# Altium project Edge_Card_Ucc28951.PrjPcb (part 1 of 3)
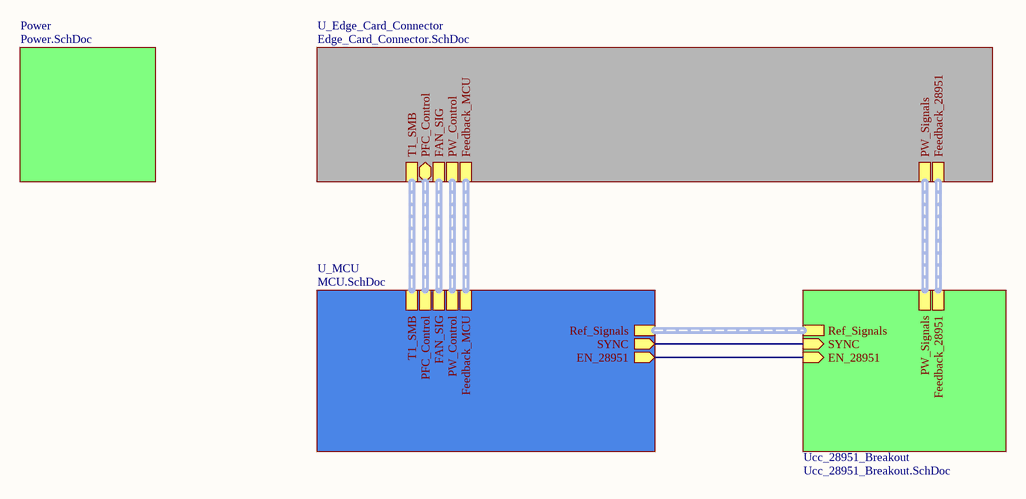
[diagram p0: Edge_Card_Ucc28951.SchDoc]
12 sheets, 320 parts. Net scope: hierarchical (ports join the sheet entries above them; power ports are global).
Board file: Edge_Card_Ucc28951.PcbDoc
Sheets:
  Edge_Card_Ucc28951.SchDoc
    U_Edge_Card_Connector = Edge_Card_Connector.SchDoc
    U_MCU = MCU.SchDoc
      MCU_Breakout = MCU_Breakout.SchDoc
        U_MCU_Power = MCU_Power.SchDoc
      MCU_JTAG = MCU_Debug.SchDoc
      MCU_USB = MCU_USB.SchDoc
      MCU_LCD = MCU_LCD.SchDoc
      IR_Reciever = IR_Reciever.SchDoc
      MCU_CAN = MCU_CAN.SchDoc
    Power = Power.SchDoc
    Ucc_28951_Breakout = Ucc_28951_Breakout.SchDoc

## Sheet Edge_Card_Ucc28951.SchDoc
size A4

### Sub-sheets
Power = Power.SchDoc: no entries
U_Edge_Card_Connector = Edge_Card_Connector.SchDoc: Feedback_28951 (harness Feedback_28951), Feedback_MCU (harness Feedback_MCU), FAN_SIG (harness FAN_SIG), PFC_Control (bidir, harness PFC_Control), T1_SMB (harness T1_SMB), PW_Signals (harness PW_Signals), PW_Control (harness PW_Control)
U_MCU = MCU.SchDoc: T1_SMB (harness T1_SMB), PFC_Control (harness PFC_Control), FAN_SIG (harness FAN_SIG), PW_Control (harness PW_Control), Feedback_MCU (harness Feedback_MCU), SYNC (out), EN_28951 (out), Ref_Signals (harness Ref_Signals)
Ucc_28951_Breakout = Ucc_28951_Breakout.SchDoc: PW_Signals (harness PW_Signals), Feedback_28951 (harness Feedback_28951), EN_28951 (in), SYNC (in), Ref_Signals (harness Ref_Signals)

### Nets
EN_28951: sheet U_MCU/EN_28951, sheet Ucc_28951_Breakout/EN_28951
SYNC: sheet U_MCU/SYNC, sheet Ucc_28951_Breakout/SYNC

### Buses and harness runs
harness sheet U_Edge_Card_Connector/FAN_SIG = sheet U_MCU/FAN_SIG
harness sheet U_Edge_Card_Connector/Feedback_28951 = sheet Ucc_28951_Breakout/Feedback_28951
harness sheet U_Edge_Card_Connector/Feedback_MCU = sheet U_MCU/Feedback_MCU
harness sheet U_Edge_Card_Connector/PFC_Control = sheet U_MCU/PFC_Control
harness sheet U_Edge_Card_Connector/PW_Control = sheet U_MCU/PW_Control
harness sheet U_Edge_Card_Connector/PW_Signals = sheet Ucc_28951_Breakout/PW_Signals
harness sheet U_Edge_Card_Connector/T1_SMB = sheet U_MCU/T1_SMB
harness sheet U_MCU/Ref_Signals = sheet Ucc_28951_Breakout/Ref_Signals

## Sheet Edge_Card_Connector.SchDoc
size A3
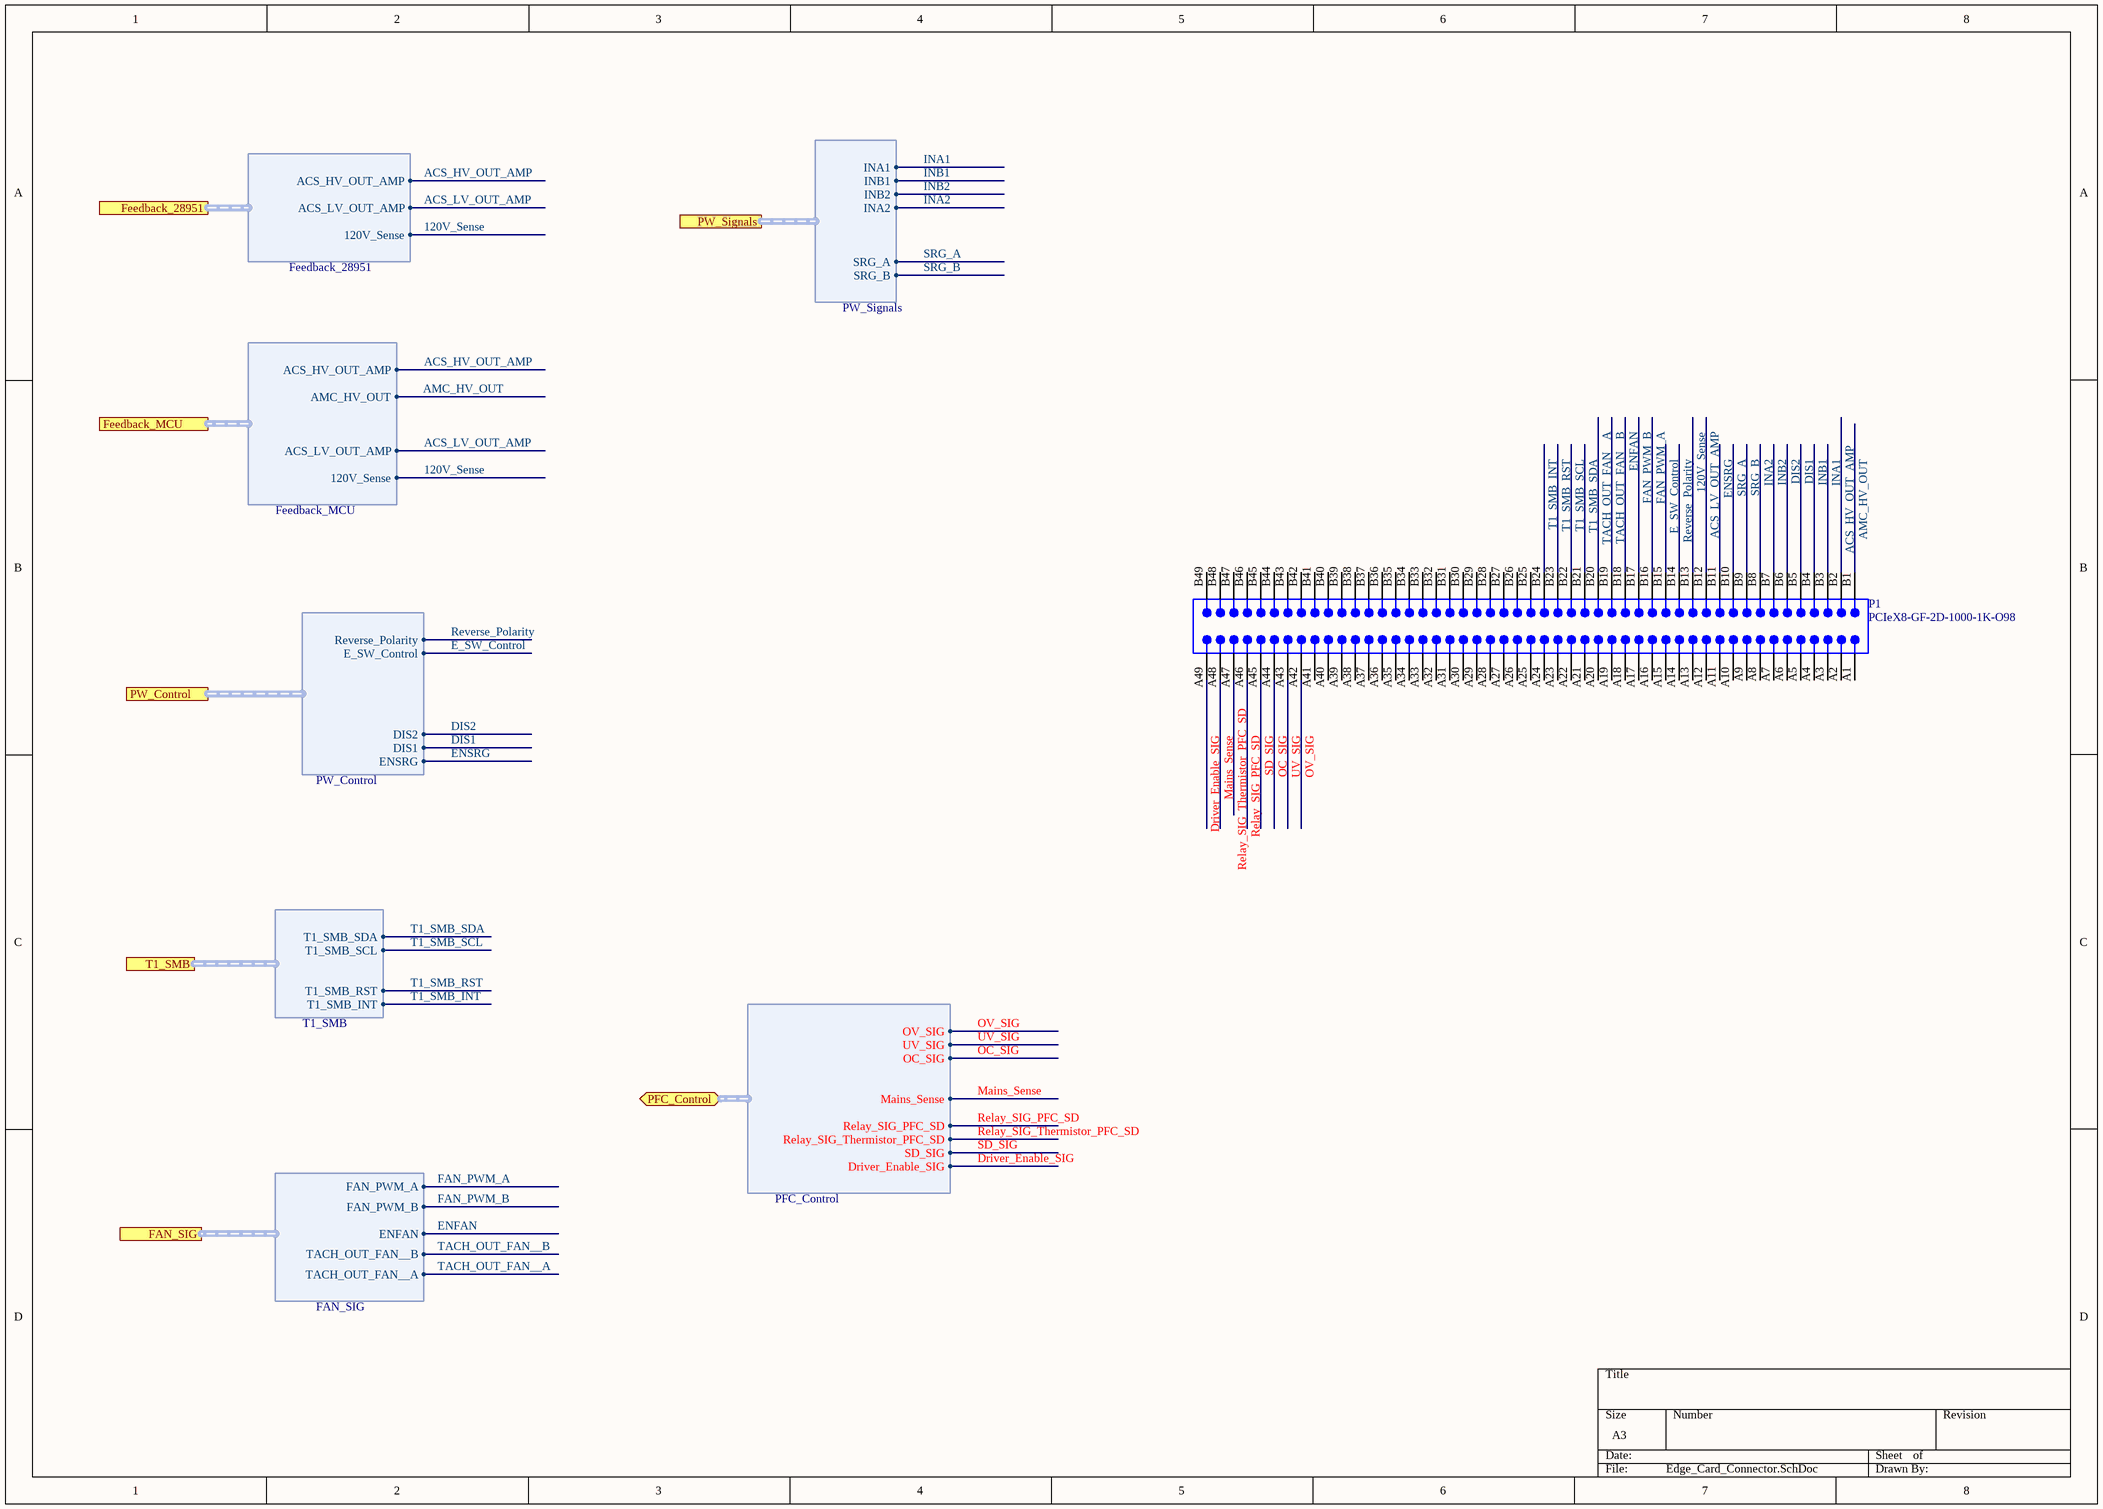
[diagram p1: Edge_Card_Connector.SchDoc]

### Parts
P1  PCIeX8-GF-2D-1000-1K-O98  [PCIeX8-GF-2D-1000-1K-O98]  (no BOM)

### Ports
FAN_SIG (harness FAN_SIG), Feedback_28951 (harness Feedback_28951), Feedback_MCU (harness Feedback_MCU), PFC_Control (bidir, harness PFC_Control), PW_Control (harness PW_Control), PW_Signals (harness PW_Signals), T1_SMB (harness T1_SMB)

### Harnesses
Feedback_28951: ACS_HV_OUT_AMP, 120V_Sense, ACS_LV_OUT_AMP
PW_Signals: INA1, INA2, INB1, INB2, SRG_A, SRG_B
Feedback_MCU: 120V_Sense, ACS_LV_OUT_AMP, ACS_HV_OUT_AMP, AMC_HV_OUT
PW_Control: E_SW_Control, Reverse_Polarity, DIS2, DIS1, ENSRG
FAN_SIG: ENFAN, FAN_PWM_A, FAN_PWM_B, TACH_OUT_FAN__A, TACH_OUT_FAN__B
T1_SMB: T1_SMB_INT, T1_SMB_RST, T1_SMB_SCL, T1_SMB_SDA
PFC_Control: Relay_SIG_Thermistor_PFC_SD, Mains_Sense, Driver_Enable_SIG, Relay_SIG_PFC_SD, UV_SIG, OV_SIG, SD_SIG, OC_SIG

### Nets
120V_Sense: P1.B13 ; port Feedback_28951.120V_Sense, port Feedback_MCU.120V_Sense
ACS_HV_OUT_AMP: P1.B2 ; port Feedback_28951.ACS_HV_OUT_AMP, port Feedback_MCU.ACS_HV_OUT_AMP
ACS_LV_OUT_AMP: P1.B12 ; port Feedback_28951.ACS_LV_OUT_AMP, port Feedback_MCU.ACS_LV_OUT_AMP
AMC_HV_OUT: P1.B1 ; port Feedback_MCU.AMC_HV_OUT
DIS1: P1.B5 ; port PW_Control.DIS1
DIS2: P1.B6 ; port PW_Control.DIS2
Driver_Enable_SIG: P1.A49 ; port PFC_Control.Driver_Enable_SIG
E_SW_Control: P1.B15 ; port PW_Control.E_SW_Control
ENFAN: P1.B18 ; port FAN_SIG.ENFAN
ENSRG: P1.B11 ; port PW_Control.ENSRG
FAN_PWM_A: P1.B16 ; port FAN_SIG.FAN_PWM_A
FAN_PWM_B: P1.B17 ; port FAN_SIG.FAN_PWM_B
INA1: P1.B3 ; port PW_Signals.INA1
INA2: P1.B8 ; port PW_Signals.INA2
INB1: P1.B4 ; port PW_Signals.INB1
INB2: P1.B7 ; port PW_Signals.INB2
Mains_Sense: P1.A48 ; port PFC_Control.Mains_Sense
OC_SIG: P1.A44 ; port PFC_Control.OC_SIG
OV_SIG: P1.A42 ; port PFC_Control.OV_SIG
Relay_SIG_PFC_SD: P1.A46 ; port PFC_Control.Relay_SIG_PFC_SD
Relay_SIG_Thermistor_PFC_SD: P1.A47 ; port PFC_Control.Relay_SIG_Thermistor_PFC_SD
Reverse_Polarity: P1.B14 ; port PW_Control.Reverse_Polarity
SD_SIG: P1.A45 ; port PFC_Control.SD_SIG
SRG_A: P1.B10 ; port PW_Signals.SRG_A
SRG_B: P1.B9 ; port PW_Signals.SRG_B
T1_SMB_INT: P1.B24 ; port T1_SMB.T1_SMB_INT
T1_SMB_RST: P1.B23 ; port T1_SMB.T1_SMB_RST
T1_SMB_SCL: P1.B22 ; port T1_SMB.T1_SMB_SCL
T1_SMB_SDA: P1.B21 ; port T1_SMB.T1_SMB_SDA
TACH_OUT_FAN__A: P1.B20 ; port FAN_SIG.TACH_OUT_FAN__A
TACH_OUT_FAN__B: P1.B19 ; port FAN_SIG.TACH_OUT_FAN__B
UV_SIG: P1.A43 ; port PFC_Control.UV_SIG

Not connected (* = marked no-connect by the designer): P1 A1 A2 A3 A4 A5 A6 A7 A8 A9 A10 A11 A12 A13 A14 A15 A16 A17 A18 A19 A20 A21 A22 A23 A24 A25 A26 A27 A28 A29 A30 A31 A32 A33 A34 A35 A36 A37 A38 A39 A40 A41 B25 B26 B27 B28 B29 B30 B31 B32 B33 B34 B35 B36 B37 B38 B39 B40 B41 B42 B43 B44 B45 B46 B47 B48 B49

### Library data of the parts
P1 = PCIeX8-GF-2D-1000-1K-O98: Golden finger, PCIeX8, Dual, Opposite, Pitch 1mm, 98-Position; Mating Connector: Molex-87715-9205; Package Version: rev2.0, Apr-2007; ClassName: Edge Connector; Package Reference: GF-2D-1000-1K-O98; Datasheet Version: rev2.0, Apr-2007; Publisher: Altium

## Sheet MCU.SchDoc
size A4
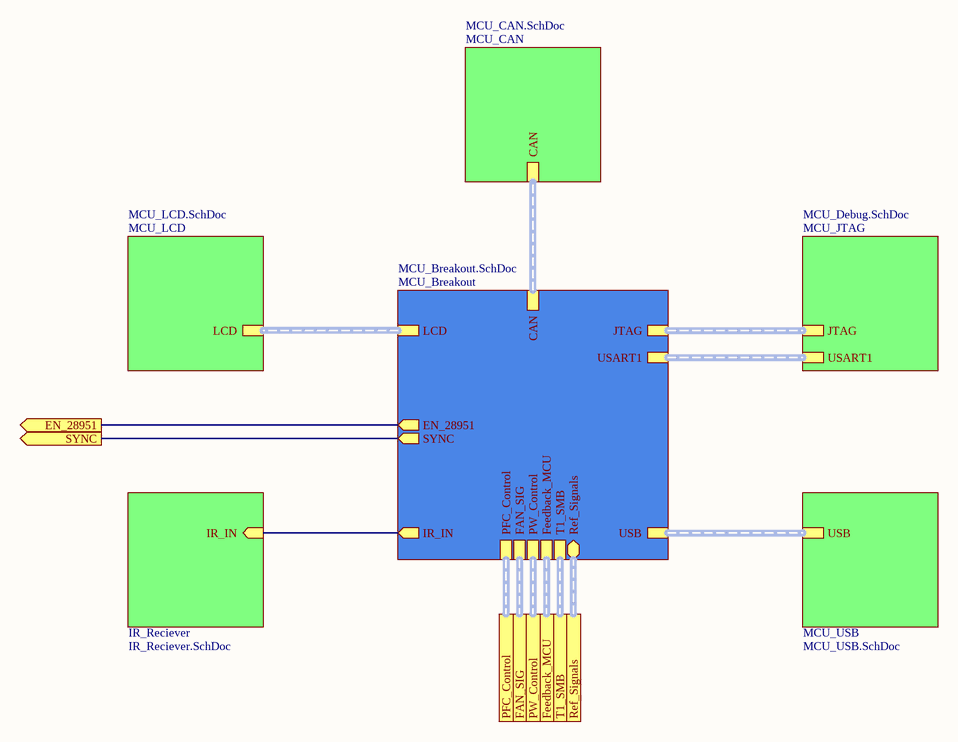
[diagram p2: MCU.SchDoc]

### Sub-sheets
IR_Reciever = IR_Reciever.SchDoc: IR_IN (in)
MCU_Breakout = MCU_Breakout.SchDoc: JTAG (harness JTAG), USB (harness USB), IR_IN (out), CAN (harness FD_CAN), LCD (harness LCD), T1_SMB (harness T1_SMB), Feedback_MCU (harness Feedback_MCU), PW_Control (harness PW_Control), FAN_SIG (harness FAN_SIG), PFC_Control (harness PFC_Control), USART1 (harness USART1), Ref_Signals (bidir, harness Ref_Signals), SYNC (out), EN_28951 (out)
MCU_CAN = MCU_CAN.SchDoc: CAN
MCU_JTAG = MCU_Debug.SchDoc: JTAG (harness JTAG), USART1 (harness USART1)
MCU_LCD = MCU_LCD.SchDoc: LCD
MCU_USB = MCU_USB.SchDoc: USB

### Ports
EN_28951 (out), FAN_SIG (harness FAN_SIG), Feedback_MCU (harness Feedback_MCU), PFC_Control (harness PFC_Control), PW_Control (harness PW_Control), Ref_Signals (harness Ref_Signals), SYNC (out), T1_SMB (harness T1_SMB)

### Nets
EN_28951: port EN_28951, sheet MCU_Breakout/EN_28951
IR_IN: sheet MCU_Breakout/IR_IN, sheet IR_Reciever/IR_IN
SYNC: port SYNC, sheet MCU_Breakout/SYNC

### Buses and harness runs
harness port FAN_SIG = sheet MCU_Breakout/FAN_SIG
harness port Feedback_MCU = sheet MCU_Breakout/Feedback_MCU
harness port PFC_Control = sheet MCU_Breakout/PFC_Control
harness port PW_Control = sheet MCU_Breakout/PW_Control
harness port Ref_Signals = sheet MCU_Breakout/Ref_Signals
harness port T1_SMB = sheet MCU_Breakout/T1_SMB
harness sheet MCU_Breakout/CAN = sheet MCU_CAN/CAN
harness sheet MCU_Breakout/JTAG = sheet MCU_JTAG/JTAG
harness sheet MCU_Breakout/LCD = sheet MCU_LCD/LCD
harness sheet MCU_Breakout/USART1 = sheet MCU_JTAG/USART1
harness sheet MCU_Breakout/USB = sheet MCU_USB/USB

## Sheet MCU_Breakout.SchDoc
size C
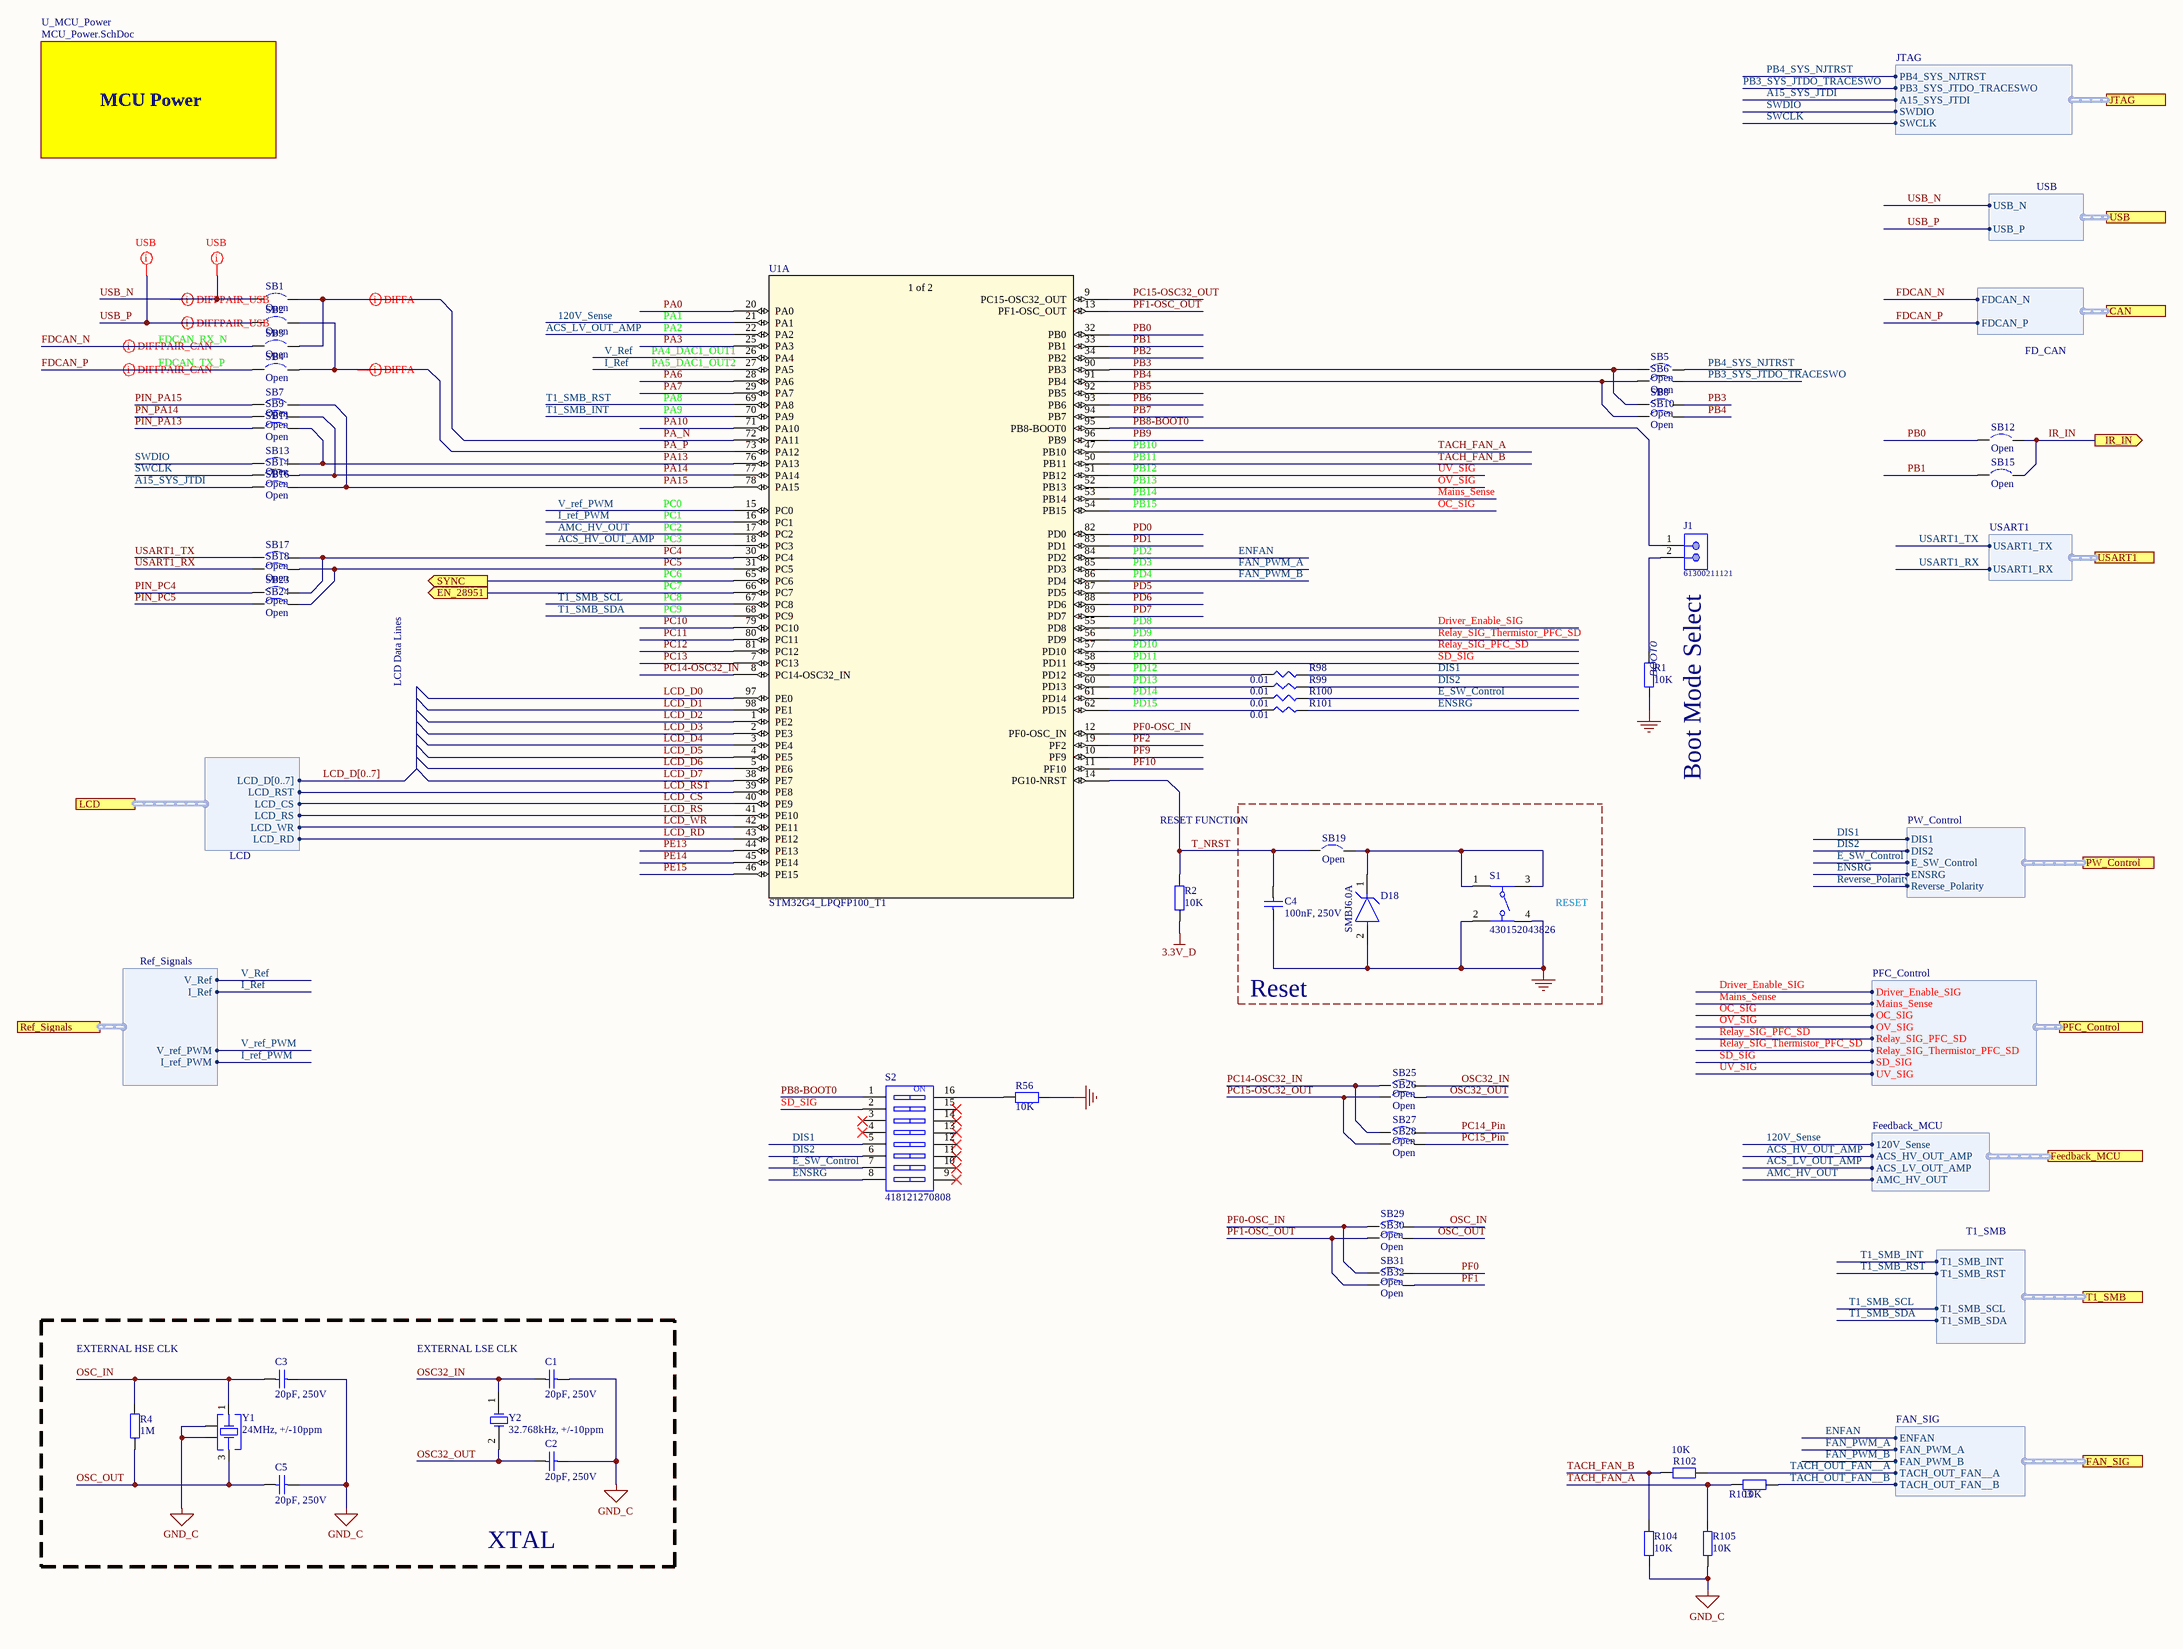
[diagram p3: MCU_Breakout.SchDoc]

### Parts
C1  20pF, 250V  [WCAP-CSMH_0603_Reflow]
C2  20pF, 250V  [WCAP-CSMH_0603_Reflow]
C3  20pF, 250V  [WCAP-CSMH_0603_Reflow]
C4  100nF, 250V  [WCAP-CSMH_0603_Reflow]
C5  20pF, 250V  [WCAP-CSMH_0603_Reflow]
D18  SMBJ6.0A  [FP-SMBJ-MFG]
J1  61300211121  [61300211121]
R1  10K  [WRIS-KSKE_0603_H=0.45mm]
R2  10K  [WRIS-KSKE_0603_H=0.45mm]
R4  1M  [WRIS-KSKE_0603_H=0.45mm]
R56  10K  [WRIS-KSKE_0603_H=0.45mm]
R98  0.01  [SMD-0603-RES]
R99  0.01  [SMD-0603-RES]
R100  0.01  [SMD-0603-RES]
R101  0.01  [SMD-0603-RES]
R102  10K  [WRIS-KSKE_0603_H=0.45mm]
R103  10K  [WRIS-KSKE_0603_H=0.45mm]
R104  10K  [WRIS-KSKE_0603_H=0.45mm]
R105  10K  [WRIS-KSKE_0603_H=0.45mm]
S1  430152043826  [430152043826]
S2  418121270808  [418121270808]
SB1  Open  [SB_0603]  (no BOM)
SB2  Open  [SB_0603]  (no BOM)
SB3  Open  [SB_0603]  (no BOM)
SB4  Open  [SB_0603]  (no BOM)
SB5  Open  [SB_0603]  (no BOM)
SB6  Open  [SB_0603]  (no BOM)
SB7  Open  [SB_0603]  (no BOM)
SB8  Open  [SB_0603]  (no BOM)
SB9  Open  [SB_0603]  (no BOM)
SB10  Open  [SB_0603]  (no BOM)
SB11  Open  [SB_0603]  (no BOM)
SB12  Open  [SB_0603]  (no BOM)
SB13  Open  [SB_0603]  (no BOM)
SB14  Open  [SB_0603]  (no BOM)
SB15  Open  [SB_0603]  (no BOM)
SB16  Open  [SB_0603]  (no BOM)
SB17  Open  [SB_0603]  (no BOM)
SB18  Open  [SB_0603]  (no BOM)
SB19  Open  [SB_0603]  (no BOM)
SB23  Open  [SB_0603]  (no BOM)
SB24  Open  [SB_0603]  (no BOM)
SB25  Open  [SB_0603]  (no BOM)
SB26  Open  [SB_0603]  (no BOM)
SB27  Open  [SB_0603]  (no BOM)
SB28  Open  [SB_0603]  (no BOM)
SB29  Open  [SB_0603]  (no BOM)
SB30  Open  [SB_0603]  (no BOM)
SB31  Open  [SB_0603]  (no BOM)
SB32  Open  [SB_0603]  (no BOM)
U1  STM32G4_LPQFP100_T1  [TSQFP50P1600X1600X160-100N]  (part A of 2)
Y1  24MHz, +/-10ppm  [WE-XTAL_CFPX-180]
Y2  32.768kHz, +/-10ppm  [WE-XTAL_IQXC-25]

### Blocks framed on the sheet
Reset: C4 D18 S1 SB19
XTAL: C1-C3 C5 R4 Y1 Y2

### Sub-sheets
U_MCU_Power = MCU_Power.SchDoc: no entries

### Ports
CAN (harness FD_CAN), EN_28951 (out), FAN_SIG (harness FAN_SIG), Feedback_MCU (harness Feedback_MCU), IR_IN (out), JTAG (harness JTAG), LCD (harness LCD), PFC_Control (harness PFC_Control), PW_Control (harness PW_Control), Ref_Signals (harness Ref_Signals), SYNC (out), T1_SMB (harness T1_SMB), USART1 (harness USART1), USB (harness USB)

### Harnesses
JTAG: PB3_SYS_JTDO_TRACESWO, PB4_SYS_NJTRST, SWDIO, SWCLK, A15_SYS_JTDI
USB: USB_N, USB_P
FD_CAN: FDCAN_N, FDCAN_P
LCD: LCD_RST, LCD_CS, LCD_RS, LCD_D[0..7], LCD_WR, LCD_RD
USART1: USART1_TX, USART1_RX
T1_SMB: T1_SMB_INT, T1_SMB_RST, T1_SMB_SCL, T1_SMB_SDA
Feedback_MCU: 120V_Sense, ACS_HV_OUT_AMP, ACS_LV_OUT_AMP, AMC_HV_OUT
PFC_Control: Driver_Enable_SIG, Mains_Sense, OC_SIG, OV_SIG, Relay_SIG_PFC_SD, Relay_SIG_Thermistor_PFC_SD, SD_SIG, UV_SIG
PW_Control: DIS1, DIS2, E_SW_Control, ENSRG, Reverse_Polarity
Ref_Signals: V_Ref, I_Ref, V_ref_PWM, I_ref_PWM
FAN_SIG: ENFAN, FAN_PWM_A, FAN_PWM_B, TACH_OUT_FAN__A, TACH_OUT_FAN__B

### Nets
3.3V_D: R2.1
GND: C4.1 D18.2(A) R1.1 R56.1 S1.2 S1.4
GND_C: C1.2 C2.2 C3.2 C5.2 R104.2 R105.2 Y1.2(GND) Y1.4(GND)
120V_Sense: U1.21(PA1) ; port Feedback_MCU.120V_Sense
A15_SYS_JTDI: SB16.2 ; port JTAG.A15_SYS_JTDI
ACS_HV_OUT_AMP: U1.18(PC3) ; port Feedback_MCU.ACS_HV_OUT_AMP
ACS_LV_OUT_AMP: U1.22(PA2) ; port Feedback_MCU.ACS_LV_OUT_AMP
AMC_HV_OUT: U1.17(PC2) ; port Feedback_MCU.AMC_HV_OUT
DIS1: R98.2 S2.5 ; port PW_Control.DIS1
DIS2: R99.2 S2.6 ; port PW_Control.DIS2
Driver_Enable_SIG: U1.55(PD8) ; port PFC_Control.Driver_Enable_SIG
E_SW_Control: R100.2 S2.7 ; port PW_Control.E_SW_Control
EN_28951: U1.66(PC7) ; port EN_28951
ENFAN: U1.84(PD2) ; port FAN_SIG.ENFAN
ENSRG: R101.2 S2.8 ; port PW_Control.ENSRG
FAN_PWM_A: U1.85(PD3) ; port FAN_SIG.FAN_PWM_A
FAN_PWM_B: U1.86(PD4) ; port FAN_SIG.FAN_PWM_B
FDCAN_N: SB3.1 ; port CAN.FDCAN_N
FDCAN_P: SB4.1 ; port CAN.FDCAN_P
I_Ref: U1.27(PA5) ; port Ref_Signals.I_Ref
I_ref_PWM: U1.16(PC1) ; port Ref_Signals.I_ref_PWM
IR_IN: SB12.1 SB15.1 ; port IR_IN
LCD_CS: U1.40(PE9) ; port LCD.LCD_CS
LCD_D0: U1.97(PE0)
LCD_D1: U1.98(PE1)
LCD_D2: U1.1(PE2)
LCD_D3: U1.2(PE3)
LCD_D4: U1.3(PE4)
LCD_D5: U1.4(PE5)
LCD_D6: U1.5(PE6)
LCD_D7: U1.38(PE7)
LCD_RD: U1.43(PE12) ; port LCD.LCD_RD
LCD_RS: U1.41(PE10) ; port LCD.LCD_RS
LCD_RST: U1.39(PE8) ; port LCD.LCD_RST
LCD_WR: U1.42(PE11) ; port LCD.LCD_WR
Mains_Sense: U1.53(PB14) ; port PFC_Control.Mains_Sense
OC_SIG: U1.54(PB15) ; port PFC_Control.OC_SIG
OSC32_IN: C1.1 SB25.1 Y2.1(OSC1)
OSC32_OUT: C2.1 SB26.1 Y2.2(OSC2)
OSC_IN: C3.1 R4.2 SB29.1 Y1.1(Crystal)
OSC_OUT: C5.1 R4.1 SB30.1 Y1.3(Crystal)
OV_SIG: U1.52(PB13) ; port PFC_Control.OV_SIG
PA0: U1.20(PA0)
PA3: U1.25(PA3)
PA6: U1.28(PA6)
PA7: U1.29(PA7)
PA10: U1.71(PA10)
PA13: SB11.1 SB13.1 U1.76(PA13)
PA14: SB9.1 SB14.1 U1.77(PA14)
PA15: SB7.1 SB16.1 U1.78(PA15)
PA_N: SB1.2 SB3.2 U1.72(PA11)
PA_P: SB2.2 SB4.2 U1.73(PA12)
PB0: SB12.2 U1.32(PB0)
PB1: SB15.2 U1.33(PB1)
PB2: U1.34(PB2)
PB3: SB5.2 SB8.1 SB8.2 U1.90(PB3)
PB3_SYS_JTDO_TRACESWO: SB6.1 ; port JTAG.PB3_SYS_JTDO_TRACESWO
PB4: SB6.2 SB10.1 SB10.2 U1.91(PB4)
PB4_SYS_NJTRST: SB5.1 ; port JTAG.PB4_SYS_NJTRST
PB5: U1.92(PB5)
PB6: U1.93(PB6)
PB7: U1.94(PB7)
PB8-BOOT0: J1.1 S2.1 U1.95(PB8-BOOT0)
PB9: U1.96(PB9)
PC4: SB17.1 SB23.1 U1.30(PC4)
PC5: SB18.1 SB24.1 U1.31(PC5)
PC10: U1.79(PC10)
PC11: U1.80(PC11)
PC12: U1.81(PC12)
PC13: U1.7(PC13)
PC14-OSC32_IN: SB25.2 SB27.2 U1.8(PC14-OSC32_IN)
PC14_Pin: SB27.1
PC15-OSC32_OUT: SB26.2 SB28.2 U1.9(PC15-OSC32_OUT)
PC15_Pin: SB28.1
PD0: U1.82(PD0)
PD1: U1.83(PD1)
PD5: U1.87(PD5)
PD6: U1.88(PD6)
PD7: U1.89(PD7)
PE13: U1.44(PE13)
PE14: U1.45(PE14)
PE15: U1.46(PE15)
PF0: SB31.1
PF0-OSC_IN: SB29.2 SB31.2 U1.12(PF0-OSC_IN)
PF1: SB32.1
PF1-OSC_OUT: SB30.2 SB32.2 U1.13(PF1-OSC_OUT)
PF2: U1.19(PF2)
PF9: U1.10(PF9)
PF10: U1.11(PF10)
PIN_PA13: SB11.2
PIN_PA15: SB7.2
PIN_PC4: SB23.2
PIN_PC5: SB24.2
PN_PA14: SB9.2
Relay_SIG_PFC_SD: U1.57(PD10) ; port PFC_Control.Relay_SIG_PFC_SD
Relay_SIG_Thermistor_PFC_SD: U1.56(PD9) ; port PFC_Control.Relay_SIG_Thermistor_PFC_SD
SD_SIG: S2.2 U1.58(PD11) ; port PFC_Control.SD_SIG
SWCLK: SB14.2 ; port JTAG.SWCLK
SWDIO: SB13.2 ; port JTAG.SWDIO
SYNC: U1.65(PC6) ; port SYNC
T1_SMB_INT: U1.70(PA9) ; port T1_SMB.T1_SMB_INT
T1_SMB_RST: U1.69(PA8) ; port T1_SMB.T1_SMB_RST
T1_SMB_SCL: U1.67(PC8) ; port T1_SMB.T1_SMB_SCL
T1_SMB_SDA: U1.68(PC9) ; port T1_SMB.T1_SMB_SDA
T_NRST: C4.2 R2.2 SB19.2 U1.14(PG10-NRST)
TACH_FAN_A: R103.2 R105.1 U1.47(PB10)
TACH_FAN_B: R102.1 R104.1 U1.50(PB11)
TACH_OUT_FAN__A: R102.2 ; port FAN_SIG.TACH_OUT_FAN__A
TACH_OUT_FAN__B: R103.1 ; port FAN_SIG.TACH_OUT_FAN__B
USART1_RX: SB18.2 ; port USART1.USART1_RX
USART1_TX: SB17.2 ; port USART1.USART1_TX
USB_N: SB1.1 ; port USB.USB_N
USB_P: SB2.1 ; port USB.USB_P
UV_SIG: U1.51(PB12) ; port PFC_Control.UV_SIG
V_Ref: U1.26(PA4) ; port Ref_Signals.V_Ref
V_ref_PWM: U1.15(PC0) ; port Ref_Signals.V_ref_PWM
NetD18_1: D18.1(C) S1.1 S1.3 SB19.1
NetJ1_2: J1.2 R1.2
NetR56_2: R56.2 S2.16
NetR98_1: R98.1 U1.59(PD12)
NetR99_1: R99.1 U1.60(PD13)
NetR100_1: R100.1 U1.61(PD14)
NetR101_1: R101.1 U1.62(PD15)

Not connected (* = marked no-connect by the designer): S2 3* 4* 9* 10* 11* 12* 13* 14* 15*

### Buses and harness runs
bus LCD_D[0..7]

### Layout directives
differential pair: FDCAN_N, FDCAN_P, PA_N, PA_P
rule Undefined; rule Matched Net Lengths [Tolerance = 0.2mm]; rule Impedance Constraint [Min = 85.00    Max = 95.00    ]: USB_N, USB_P
differential pair; rule Impedance Constraint [Min = 85.00    Max = 95.00    ]: USB_N, USB_P

### Notes on the sheet
- MCU Power
- FDCAN_RX_N
- PA4_DAC1_OUT1
- PA1
- PA2
- FDCAN_TX_P
- PA5_DAC1_OUT2
- PA9
- PA8
- PB12
- PB11
- PB10
- PC0
- PC1
- PC2
- PB13
- PB14
- PB15
- PC3
- PC6
- PC7
- PD3
- PD4
- PD2
- PC9
- PC8
- PD8
- PD9
- PD10
- (near R1) BOOT0
- LCD Data Lines
- PD11
- PD12
- PD13
- PD14
- PD15
- (near SB19) RESET FUNCTION
- Boot Mode Select
- (near S1) RESET
- EXTERNAL HSE CLK
- EXTERNAL LSE CLK
- (in symbol 418121270808) ON
- (in symbol STM32G4_LPQFP100, part A) 1 of 2

### Library data of the parts
C1-C5 = 885342006002: WCAP-CSMH Ceramic Capacitors, size 0603, 33pF, 250VDC; Ceramic Type: NP0 Class I; Insulation Resistance: 10GOhm; Technical Reference: NP00603330J250DFCT10000; ComponentLink1Description: Manufacturer; ComponentLink1URL: http://www.we-online.de; ComponentLink2Description: Datasheet; ComponentLink2URL: https://katalog.we-online.com/pbs/datasheet/885342006002.pdf; Packaging: Tape and Reel; Part Number: 885342006002; Published Date: August 2019; Rated Voltage: 250VDC; Size: 0603; Mounting Technology: SMD; Publisher: Wurth Elektronik; Capacitance: 33pF; Dissipation Factor: -; Operating Temperature: -55 to +125degC
D18 = CMP-08607-000069-1: TVS DIODE 6V 10.3V DO214AA; Manufacturer: Littelfuse Inc; Breakdown Voltage: 6.67V; Direction: Unidirectional; Number Of Channels: 1; Peak Pulse Power: 600W; Peak Pulse Current: 58.3A; Max Junction Temp: +150°C; Category: Diode; ComponentLink2Description: Datasheet; Octopart: https://octopart.com/smbj6.0a-littelfuse-66100; Clamping Voltage: 10.3V; Device Class L3: unset; Temperature Range Low: -65°C; Temperature: -65°C to +150°C; ComponentLink2URL: https://www.littelfuse.com/~/media/electronics/datasheets/tvs_diodes/littelfuse_tvs_diode_smbj_datasheet.pdf.pdf; Height: 2.61mm; Digikey Description: TVS DIODE 6V 10.3V DO214AA; Manufacturer Part Number: SMBJ6.0A; Temperature Range High: +150°C; Device Class L2: TVS Diodes; Mouser Description: In a Pack of 10, Littelfuse SMBJ6.0A, Uni-Directional TVS Diode, 600W, 2-Pin DO-214AA; Automotive: No; RoHS: TRUE; Device Class L1: Circuit Protection; Reverse Standoff Voltage: 6V; Lead Free: Yes; Package: SMBJ
J1 = 61300211121: WR-PHD Pin Header, THT, pitch 2.54mm, Single Row, Vertical, 2pin; Pin Number: 2; Gender: Male; Rated Current: 3A; Working Voltage: 250VAC; Withstanding Voltage: 500VAC; Contact Resistance: 20mOhm; ComponentLink1Description: Manufacturer; ComponentLink1URL: http://www.we-online.de; ComponentLink2Description: Datasheet; ComponentLink2URL: https://katalog.we-online.de/em/datasheet/6130xx11121.pdf; Part Number: 61300211121; Published Date: June 2019; Publisher: Wurth Elektronik; Pitch: 2.54mm; Operating Temperature: -40 to +105degC; Mounting Technology: THT; Packaging: Bag; Row Number: Single; Orientation: Vertical
R1 R2 R4 R56 R102-R105 = 560050316011: WRIS-KSKE Thick Film Resistors, size 0603, 0.5Ohm, +/-1%, 0.25W; Rated Current: 0.7A; Temperature Coefficient of Resistance: +/-100ppm/degC; Technical Reference: KE0603R500F104KAATP0000; ComponentLink1Description: Manufacturer; ComponentLink1URL: http://www.we-online.de; ComponentLink2Description: Datasheet; ComponentLink2URL: https://katalog.we-online.com/pbs/datasheet/560050316011.pdf; Publisher: Wurth Elektronik; Rated Power: 0.25W; Resistance: 0.5Ohm; Mounting Technology: SMT; Height: 0.45mm; Part Number: 560050316011; Packaging: Tape and Reel; Published Date: September 2019; Size: 0603; Length: 1.6mm; Operating Temperature: -55 to +155degC; Resistance Tolerance: +/-1%; Width: 0.8mm
R98-R101 = ERJ-3LWFR010V: RES SMD 0.01 OHM 1% 1/4W 0603; Manufacturer: Panasonic Electronic Components; Factory Stock: 0; Unit Price (USD): 0.09082; @ qty: 1500; Minimum Quantity: 1; Power (Watts): 0.25W, 1/4W; Temperature Coefficient: 0/ +300ppm/°C; Part Number: ERJ-3LWFR010V; Datasheets: https://industrial.panasonic.com/cdbs/www-data/pdf/RDA0000/AOA0000C239.pdf; Image: //media.digikey.com/Photos/Panasonic%20Photos/MFG_ERJ-P6W%20Series.jpg; Digi-Key Part Number: P19180CT-ND; Quantity Available: 105; Packaging: Cut Tape (CT); Series: ERJ; Part Status: Active; Value: 0.01; Tolerance: ±1%; Composition: Thick Film; Features: Automotive AEC-Q200, Current Sense; Operating Temperature: -55°C ~ 125°C; Package / Case: 0603 (1608 Metric); Supplier Device Package: 0603; Size / Dimension: 0.063" L x 0.031" W (1.60mm x 0.80mm); Height - Seated (Max): 0.026" (0.65mm); Number of Terminations: 2; Failure Rate: -
S1 = 430152043826: WS-TASV SMT Tact Switch 6x6mm, height 4.3mm, 260gf; Rated Voltage: 12VDC; Rated Current: 50mA; Washable: No; ComponentLink1Description: Manufacturer; ComponentLink1URL: http://www.we-online.de; ComponentLink2Description: Datasheet; ComponentLink2URL: https://katalog.we-online.com/em/datasheet/430152043826.pdf; Operating Temperature: -40 to +85degC; Part Number: 430152043826; Published Date: September 2019; Contact Material: Stainless Steel; Height: 4.3mm; Mounting Technology: SMT; Contact Plating: Silver; Operation Force: 260gf; Packaging: Tape and Reel; Terminal Material: Copper Alloy; Publisher: Wurth Elektronik; Terminal Plating: Silver
S2 = 418121270808: WS-DISV Small Compact SMT Dip Switch, Raised Actuator, pitch 2.54mm, 8p; Operation Force: 600g; Pole Number: 8; Actuator Type: Raise Type; Circuit: SPST-NO; Rated Current Switching: 25mA; Rated Current Non-Switching: 100mA; Rated Voltage Non-Switching: 50VDC; Rated Voltage Switching: 24VDC; ComponentLink1Description: Manufacturer; ComponentLink1URL: http://www.we-online.de; ComponentLink2Description: Datasheet; ComponentLink2URL: https://katalog.we-online.com/em/datasheet/418121270808.pdf; Pitch: 2.54mm; Contact Material: Copper Alloy; Mounting Technology: SMT; Operating Temperature: -40 to +85degC; Contact Plating: Gold; Packaging: Tape and Reel; Part Number: 418121270808; Publisher: Wurth Elektronik; Published Date: September 2019
SB1-SB19 SB23-SB32 = Solder Bridge: Circuit Breaker; Published: 24-Mar-1999; Revision: July-2002: Re-released for DXP Platform.; Publisher: Altium Limited
U1 = STM32G4_LPQFP100: No Description Available; Vendor: STMicroelectronics; Built_By: EMA_Jessica; Manufacturer_Part_Number: STM32G4_LPQFP100_T1; Copyright: Copyright (C) 2016 Accelerated Designs. All rights reserved; RefDes: RefDes; Type: DEV
Y1 = 830058149: WE-XTAL Quartz Crystal, SMT, CFPX-180, 24MHz, +/-10ppm; Load Capacitance: 10pF; ComponentLink1Description: Manufacturer; ComponentLink1URL: http://www.we-online.de; ComponentLink2Description: Datasheet; ComponentLink2URL: https://katalog.we-online.com/pbs/datasheet/830058149.pdf; Operating Temperature: -20 to +70degC; Packaging: Tape and Reel; Part Number: 830058149; Published Date: November 2019; Size: CFPX-180; Frequency Stability: +/-10ppm; Frequency: 24MHz; Frequency Tolerance: +/-10ppm; Mounting Technology: SMT; Publisher: Wurth Elektronik
Y2 = 830062558: WE-XTAL Watch Crystal, SMT, IQXC-25, 32.768kHz, +/-10ppm; Load Capacitance: 9pF; ComponentLink1Description: Manufacturer; ComponentLink1URL: http://www.we-online.de; ComponentLink2Description: Datasheet; ComponentLink2URL: https://katalog.we-online.com/pbs/datasheet/830062558.pdf; Operating Temperature: -40 to +85degC; Packaging: Tape and Reel; Part Number: 830062558; Published Date: November 2019; Size: IQXC-25; Frequency Stability: -; Frequency: 32.768kHz; Frequency Tolerance: +/-10ppm; Mounting Technology: SMT; Publisher: Wurth Elektronik

## Sheet MCU_Power.SchDoc
size A3
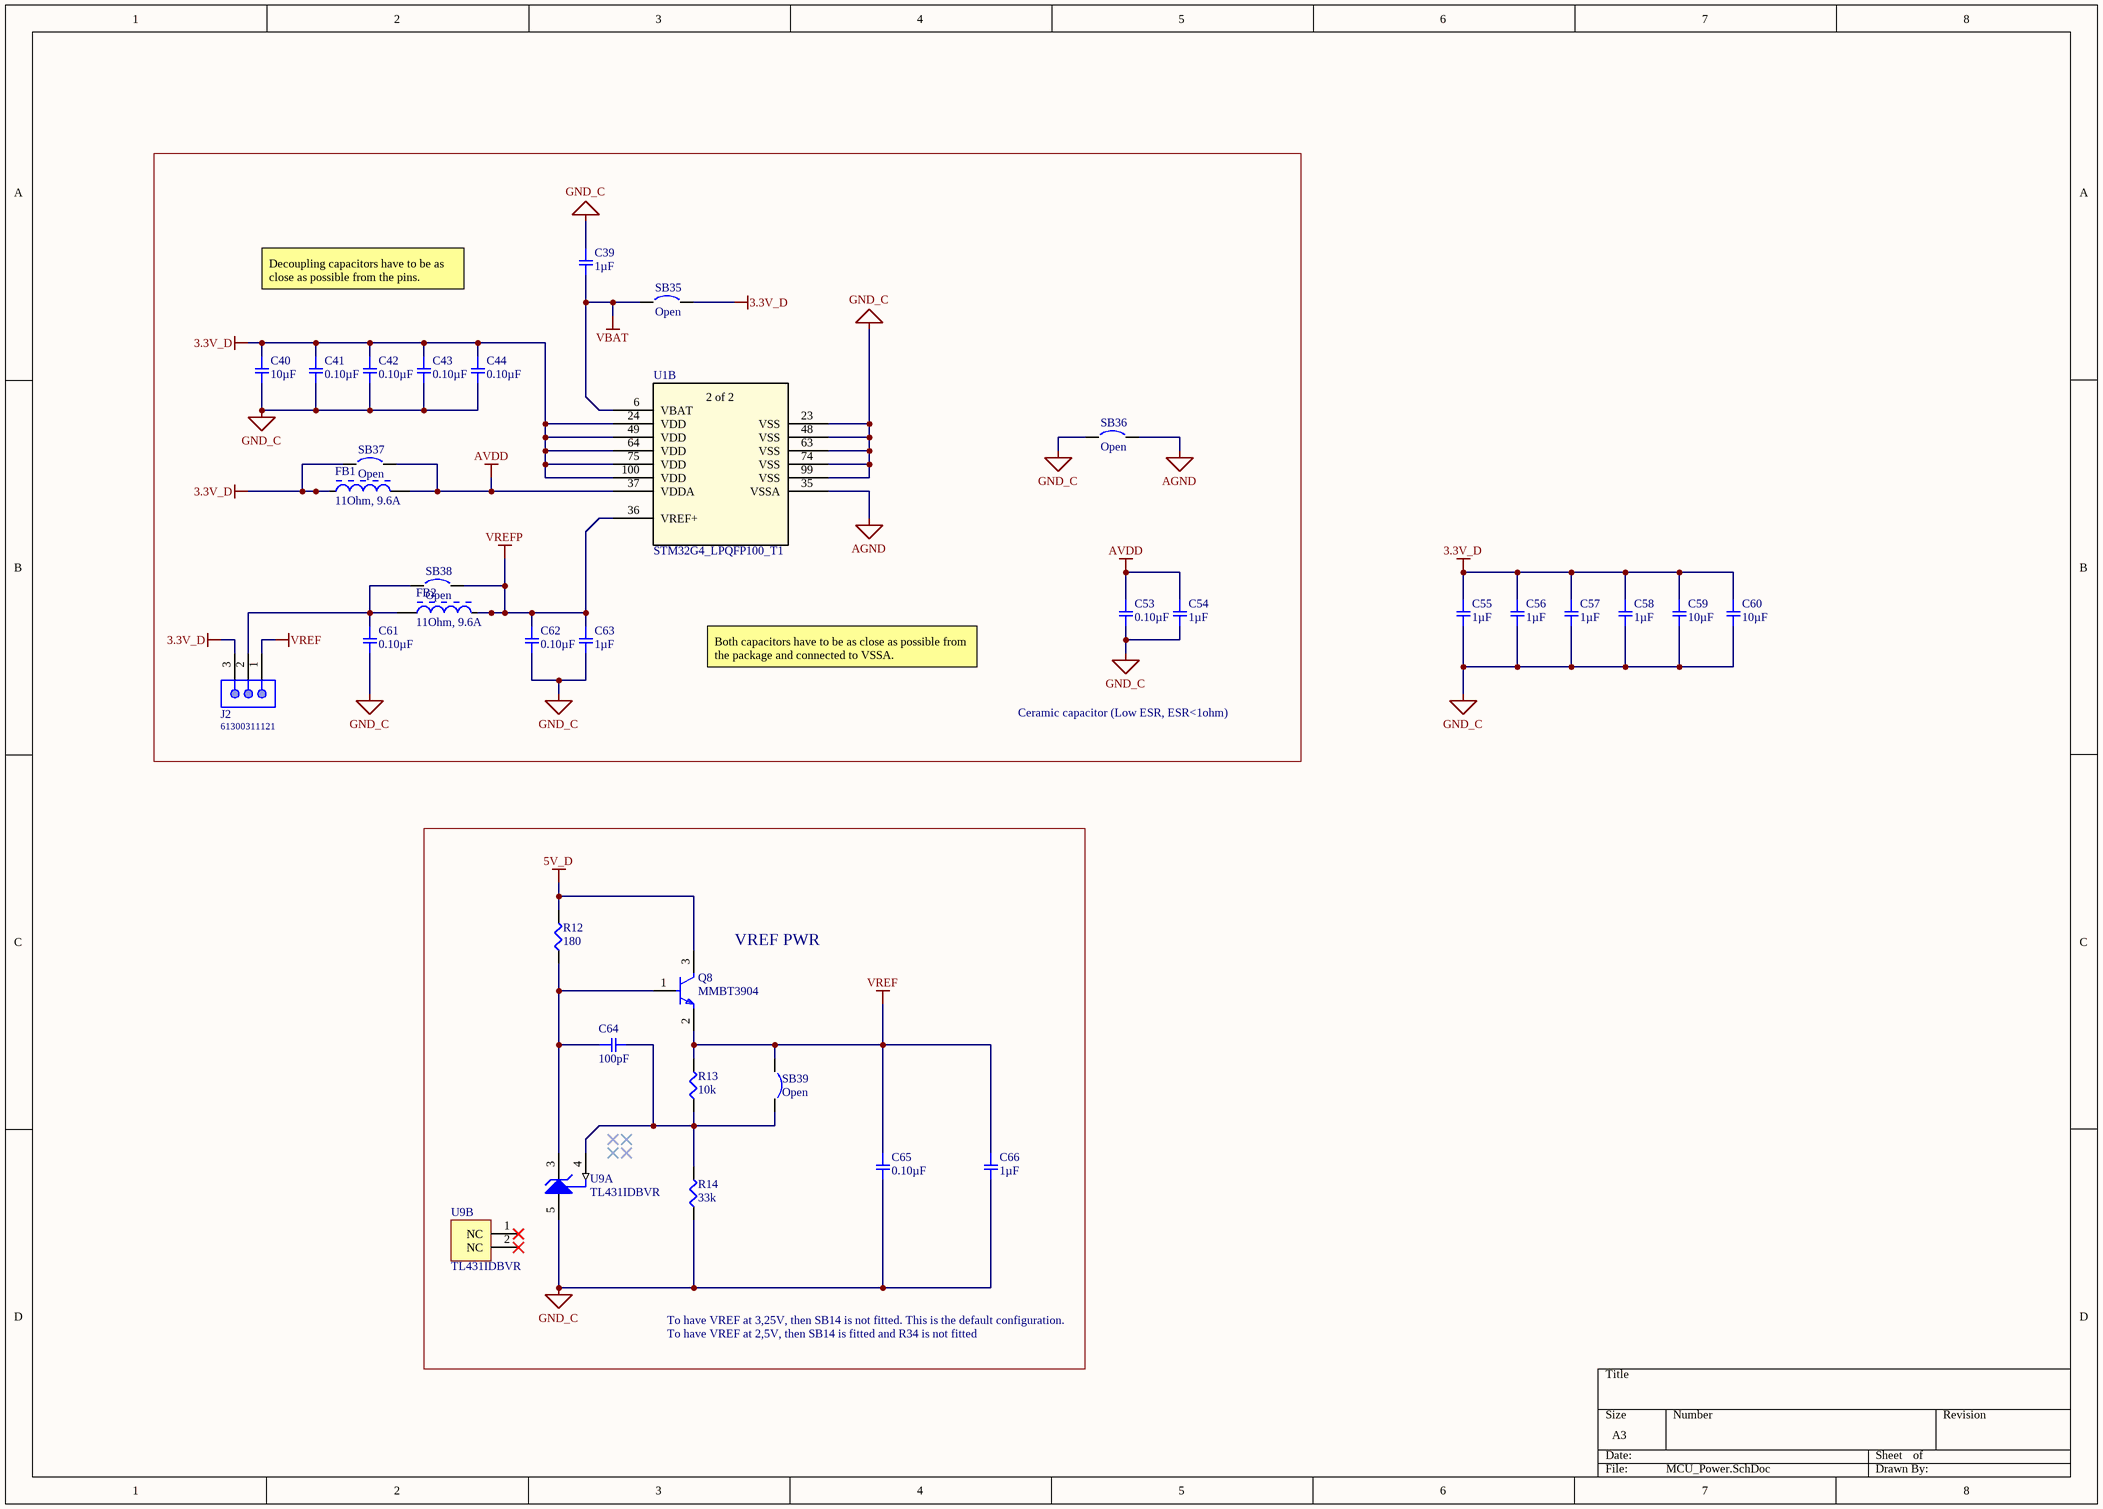
[diagram p4: MCU_Power.SchDoc]

### Parts
C39  1µF  [SMD-0805C]
C40  10µF  [SMD-0805C]
C41  0.10µF  [SMD-0805C]
C42  0.10µF  [SMD-0805C]
C43  0.10µF  [SMD-0805C]
C44  0.10µF  [SMD-0805C]
C53  0.10µF  [SMD-0805C]
C54  1µF  [SMD-0805C]
C55  1µF  [SMD-0805C]
C56  1µF  [SMD-0805C]
C57  1µF  [SMD-0805C]
C58  1µF  [SMD-0805C]
C59  10µF  [SMD-0805C]
C60  10µF  [SMD-0805C]
C61  0.10µF  [SMD-0805C]
C62  0.10µF  [SMD-0805C]
C63  1µF  [SMD-0805C]
C64  100pF  [SMD-0805C]
C65  0.10µF  [SMD-0805C]
C66  1µF  [SMD-0805C]
FB1  11Ohm, 9.6A  [WE-CBF_0805_High Speed]
FB2  11Ohm, 9.6A  [WE-CBF_0805_High Speed]
J2  61300311121  [61300311121]
Q8  MMBT3904  [FP-MA03D-MFG]
R12  180  [SMD-0603-RES]
R13  10k  [SMD-0603-RES]
R14  33k  [SMD-0603-RES]
SB35  Open  [SB_0603]  (no BOM)
SB36  Open  [SB_0603]  (no BOM)
SB37  Open  [SB_0603]  (no BOM)
SB38  Open  [SB_0603]  (no BOM)
SB39  Open  [SB_0603]  (no BOM)
U1  STM32G4_LPQFP100_T1  [TSQFP50P1600X1600X160-100N]  (part B of 2)
U9  TL431IDBVR  [DBV0005A_M]  (parts A,B of 2)

### Blocks framed on the sheet
Ceramic capacitor (Low ESR, ESR<1ohm): C39-C44 C53 C54 C61-C63 FB1 FB2 J2 SB35-SB38 U1
VREF PWR: C64-C66 Q8 R12-R14 SB39 U9

### Nets
3.3V_D: C40.1 C41.1 C42.1 C43.1 C44.1 C55.1 C56.1 C57.1 C58.1 C59.1 C60.1 FB1.1 J2.3 SB35.2 SB37.1 U1.24(VDD) U1.49(VDD) U1.64(VDD) U1.75(VDD) U1.100(VDD)
5V_D: Q8.3(C) R12.2
AGND: SB36.2 U1.35(VSSA)
AVDD: C53.1 C54.1 FB1.2 SB37.2 U1.37(VDDA)
GND_C: C39.1 C40.2 C41.2 C42.2 C43.2 C44.2 C53.2 C54.2 C55.2 C56.2 C57.2 C58.2 C59.2 C60.2 C61.2 C62.2 C63.2 C65.2 C66.2 R14.1 SB36.1 U1.23(VSS) U1.48(VSS) U1.63(VSS) U1.74(VSS) U1.99(VSS) U9.5(ANODE)
VBAT: C39.2 SB35.1 U1.6(VBAT)
VREF: C65.1 C66.1 J2.1 Q8.2(E) R13.2 SB39.1
VREFP: C62.1 C63.1 FB2.2 SB38.2 U1.36(VREF+)
NetC61_1: C61.1 FB2.1 J2.2 SB38.1
NetC64_1: C64.1 Q8.1(B) R12.1 U9.3(CATHODE)
NetC64_2: C64.2 R13.1 R14.2 SB39.2 U9.4(REF)

Not connected (* = marked no-connect by the designer): U9 1(NC)* 2(NC)*

### Notes on the sheet
- Decoupling capacitors have to be as close as possible from the pins.
- Both capacitors have to be as close as possible from the package and connected to VSSA.
- To have VREF at 3,25V, then SB14 is not fitted. This is the default configuration.
- To have VREF at 2,5V, then SB14 is fitted and R34 is not fitted
- (in symbol STM32G4_LPQFP100, part B) 2 of 2

### Library data of the parts
C39 C54-C58 C63 C66 = GCM219R71C105KA37D: CAP CER 1UF 16V X7R 0805; Manufacturer: Murata Electronics North America; Factory Stock: 0; Unit Price (USD): 0.17; Minimum Quantity: 1; Tolerance: ±10%; Datasheets: http://www.murata.com/~/media/webrenewal/support/library/catalog/products/capacitor/mlcc/c03e.ashx; Image: //media.digikey.com/photos/Murata%20Photos/NCP,GCM%20SERIES%200805.jpg; Digi-Key Part Number: 490-8043-1-ND; Part Number: GCM219R71C105KA37D; Quantity Available: 11770; @ qty: 0; Packaging: Cut Tape (CT); Series: GCM; Part Status: Active; Value: 1µF; Voltage: 16V; Temperature Coefficient: X7R; Operating Temperature: -55°C ~ 125°C; Features: -; Ratings: AEC-Q200; Applications: Automotive; Mounting Type: Surface Mount, MLCC; Package / Case: 0805 (2012 Metric); Size / Dimension: 0.079" L x 0.049" W (2.00mm x 1.25mm); Height - Seated (Max): -; Thickness (Max): 0.037" (0.95mm); Lead Spacing: -; Lead Style: -
C40 C59 C60 = GCM21BR71A106KE22L: CAP CER 10UF 10V X7R 0805; Manufacturer: Murata Electronics North America; Factory Stock: 0; Unit Price (USD): 0.49; Minimum Quantity: 1; Tolerance: ±10%; Datasheets: http://www.murata.com/~/media/webrenewal/support/library/catalog/products/capacitor/mlcc/c03e.ashx; Image: //media.digikey.com/photos/Murata%20Photos/NCP,GCM%20SERIES%200805.jpg; Digi-Key Part Number: 490-10674-1-ND; Part Number: GCM21BR71A106KE22L; Quantity Available: 125344; @ qty: 0; Packaging: Cut Tape (CT); Series: GCM; Part Status: Active; Value: 10µF; Voltage: 10V; Temperature Coefficient: X7R; Operating Temperature: -55°C ~ 125°C; Features: -; Ratings: AEC-Q200; Applications: Automotive; Mounting Type: Surface Mount, MLCC; Package / Case: 0805 (2012 Metric); Size / Dimension: 0.079" L x 0.049" W (2.00mm x 1.25mm); Height - Seated (Max): -; Thickness (Max): 0.055" (1.40mm); Lead Spacing: -; Lead Style: -
C41-C44 C53 C61 C62 C65 = GCJ21BR72A104KA01L: CAP CER 0.1UF 100V X7R 0805; Manufacturer: Murata Electronics North America; Factory Stock: 0; Unit Price (USD): 0.32; Minimum Quantity: 1; Tolerance: ±10%; Datasheets: http://www.murata.com/~/media/webrenewal/support/library/catalog/products/capacitor/mlcc/c03e.ashx; Image: //media.digikey.com/Renders/Murata%20Renders/0805%20(2012%20Metric)%20.85mm.jpg; Digi-Key Part Number: 490-5825-1-ND; Part Number: GCJ21BR72A104KA01L; Quantity Available: 1873; @ qty: 0; Packaging: Cut Tape (CT); Series: GCJ; Part Status: Active; Value: 0.10µF; Voltage: 100V; Temperature Coefficient: X7R; Operating Temperature: -55°C ~ 125°C; Features: Soft Termination; Ratings: AEC-Q200; Applications: Automotive, Boardflex Sensitive; Mounting Type: Surface Mount, MLCC; Package / Case: 0805 (2012 Metric); Size / Dimension: 0.079" L x 0.049" W (2.00mm x 1.25mm); Height - Seated (Max): -; Thickness (Max): 0.049" (1.25mm); Lead Spacing: -; Lead Style: -
C64 = GCM2165C2A101JA16J: CAP CER 100PF 100V NP0 0805; Manufacturer: Murata Electronics North America; Factory Stock: 0; Unit Price (USD): 0.17; Minimum Quantity: 1; Tolerance: ±5%; Temperature Coefficient: C0G, NP0; Datasheets: http://www.murata.com/~/media/webrenewal/support/library/catalog/products/capacitor/mlcc/c03e.ashx; Image: //media.digikey.com/Renders/Murata%20Renders/0805%28GxM6%29.jpg; Digi-Key Part Number: 490-8036-1-ND; Part Number: GCM2165C2A101JA16J; Quantity Available: 19299; @ qty: 0; Packaging: Cut Tape (CT); Series: GCM; Part Status: Active; Value: 100pF; Voltage: 100V; Operating Temperature: -55°C ~ 125°C; Features: -; Ratings: AEC-Q200; Applications: Automotive; Mounting Type: Surface Mount, MLCC; Package / Case: 0805 (2012 Metric); Size / Dimension: 0.079" L x 0.049" W (2.00mm x 1.25mm); Height - Seated (Max): -; Thickness (Max): 0.028" (0.70mm); Lead Spacing: -; Lead Style: -
FB1 FB2 = 7427920: WE-CBF SMT EMI Suppression Ferrite Bead, size 0805, 11Ohm, 9.6A; Manufacturer: Wurth Elektronik; Impedance max.: 24Ohm; DC Resistance max.: 0.15Ohm; Type: High Speed; ComponentLink1Description: Manufacturer; ComponentLink1URL: http://www.we-online.de; ComponentLink2Description: Datasheet; ComponentLink2URL: https://www.we-online.com/catalog/datasheet/7427920.pdf; Operating Temperature: -55 to +125degC; Packaging: Tape and Reel; Published Date: March 2020; Rated Current: 9.6A; Manufacturer Part Number: 7427920; Impedance @100MHz: 11Ohm; Mounting Technology: SMT; Size: 0805
J2 = 61300311121: WR-PHD Pin Header, THT, pitch 2.54mm, Single Row, Vertical, 3pin; Pin Number: 3; Gender: Male; Rated Current: 3A; Working Voltage: 250VAC; Withstanding Voltage: 500VAC; Contact Resistance: 20mOhm; ComponentLink1Description: Manufacturer; ComponentLink1URL: http://www.we-online.de; ComponentLink2Description: Datasheet; ComponentLink2URL: https://katalog.we-online.de/em/datasheet/6130xx11121.pdf; Part Number: 61300311121; Published Date: June 2019; Publisher: Wurth Elektronik; Pitch: 2.54mm; Operating Temperature: -40 to +105degC; Mounting Technology: THT; Packaging: Bag; Row Number: Single; Orientation: Vertical
Q8 = CMP-07170-000026-1: TRANS NPN 40V 0.2A SOT-23; Frequency: 300MHz; hFE Min: 100; Power Dissipation: 350mW; Element Configuration: Single; Collector Base Voltage (VCBO): 60V; Max Collector Current: 200mA; Number of Elements: 1; Emitter Base Voltage (VEBO): 6V; Collector Emitter Saturation Voltage: 300mV; REACH SVHC: No SVHC; Width: 0.25inch; Mount: Surface Mount; Height: 0.25inch; Case/Package: SOT-23; Radiation Hardening: No; Max Power Dissipation: 350mW; Gain Bandwidth Product: 300MHz; Max Frequency: 300MHz; Collector Emitter Voltage (VCEO): 40V; Max Operating Temperature: 150°C; Termination: SMD/SMT; Weight: 0.03g; Contact Plating: Tin; Package Quantity: 1; Current Rating: 200mA; Max Breakdown Voltage: 40V; Polarity: NPN; Min Operating Temperature: -55°C; Lead Free: Lead Free; Length: 0.25inch; Collector Emitter Breakdown Voltage: 40V; Packaging: Tape and Reel; Voltage Rating (DC): 40V; Number of Pins: 3; Transition Frequency: 300MHz
R12 = ERJ-3EKF1800V: RES SMD 180 OHM 1% 1/10W 0603; Manufacturer: Panasonic Electronic Components; Factory Stock: 0; Unit Price (USD): 0.00379; @ qty: 1500; Minimum Quantity: 1; Power (Watts): 0.1W, 1/10W; Temperature Coefficient: ±100ppm/°C; Part Number: ERJ-3EKF1800V; Datasheets: http://industrial.panasonic.com/www-cgi/jvcr13pz.cgi?E+PZ+3+AOA0002+ERJ3EKF1800V+7+WW; Image: //media.digikey.com/Photos/Panasonic%20Photos/MFG_ERJ-P6W%20Series.jpg; Digi-Key Part Number: P180HCT-ND; Quantity Available: 115705; Packaging: Cut Tape (CT); Series: ERJ; Part Status: Active; Value: 180; Tolerance: ±1%; Composition: Thick Film; Features: Automotive AEC-Q200; Operating Temperature: -55°C ~ 155°C; Package / Case: 0603 (1608 Metric); Supplier Device Package: 0603; Size / Dimension: 0.063" L x 0.031" W (1.60mm x 0.80mm); Height - Seated (Max): 0.022" (0.55mm); Number of Terminations: 2; Failure Rate: -
R13 = ERJ-3EKF1002V: RES SMD 10K OHM 1% 1/10W 0603; Manufacturer: Panasonic Electronic Components; Factory Stock: 0; Unit Price (USD): 0.00379; @ qty: 1500; Minimum Quantity: 1; Power (Watts): 0.1W, 1/10W; Temperature Coefficient: ±100ppm/°C; Part Number: ERJ-3EKF1002V; Datasheets: http://industrial.panasonic.com/www-cgi/jvcr13pz.cgi?E+PZ+3+AOA0002+ERJ3EKF1002V+7+WW; Image: //media.digikey.com/Photos/Panasonic%20Photos/MFG_ERJ-P6W%20Series.jpg; Digi-Key Part Number: P10.0KHCT-ND; Quantity Available: 6703141; Packaging: Cut Tape (CT); Series: ERJ; Part Status: Active; Value: 10k; Tolerance: ±1%; Composition: Thick Film; Features: Automotive AEC-Q200; Operating Temperature: -55°C ~ 155°C; Package / Case: 0603 (1608 Metric); Supplier Device Package: 0603; Size / Dimension: 0.063" L x 0.031" W (1.60mm x 0.80mm); Height - Seated (Max): 0.022" (0.55mm); Number of Terminations: 2; Failure Rate: -
R14 = ERJ-3EKF3302V: RES SMD 33K OHM 1% 1/10W 0603; Manufacturer: Panasonic Electronic Components; Factory Stock: 0; Unit Price (USD): 0.00379; @ qty: 1500; Minimum Quantity: 1; Power (Watts): 0.1W, 1/10W; Temperature Coefficient: ±100ppm/°C; Part Number: ERJ-3EKF3302V; Datasheets: http://industrial.panasonic.com/www-cgi/jvcr13pz.cgi?E+PZ+3+AOA0002+ERJ3EKF3302V+7+WW; Image: //media.digikey.com/Photos/Panasonic%20Photos/MFG_ERJ-P6W%20Series.jpg; Digi-Key Part Number: P33.0KHCT-ND; Quantity Available: 240194; Packaging: Cut Tape (CT); Series: ERJ; Part Status: Active; Value: 33k; Tolerance: ±1%; Composition: Thick Film; Features: Automotive AEC-Q200; Operating Temperature: -55°C ~ 155°C; Package / Case: 0603 (1608 Metric); Supplier Device Package: 0603; Size / Dimension: 0.063" L x 0.031" W (1.60mm x 0.80mm); Height - Seated (Max): 0.022" (0.55mm); Number of Terminations: 2; Failure Rate: -
SB35-SB39 = Solder Bridge: Circuit Breaker; Published: 24-Mar-1999; Revision: July-2002: Re-released for DXP Platform.; Publisher: Altium Limited
U1 = STM32G4_LPQFP100: as U1 on sheet MCU_Breakout; Manufacturer_Part_Number: STM32G4_LPQFP100_T1; Copyright: Copyright (C) 2016 Accelerated Designs. All rights reserved; RefDes: RefDes; Type: DEV
U9 = CMP-0366-00644-2: Adjustable Precision Shunt Regulator, 34 ppm / degC, 100 mA, -40 to 85 degC, 5-pin SOT-23 (DBV), Green (RoHS & no Sb/Br); Manufacturer: Texas Instruments; Iout/Iz(Max)(mA): 100; Min Iz for Regulation(uA): 600; Temp Coeff(Typ)(ppm/ degree C): 34; SubFamily: Shunt Voltage Reference; Temp Coeff(Max)(ppm/ degree C): 92; VO Adj(Min)(V): 2.495; Rating: Military; VO Adj(Max)(V): 36; Initial Accuracy @ 25/deg C(%): 2; Eco-Plan: Green (RoHS & no Sb/Br); Mounting Technology: Surface Mount; Code_JEDEC: MO-178; DatasheetVersion: SLVS543M; ComponentLink3Description: Package Specification; PackageReference: DBV0005A; ComponentLink3URL: http://www.ti.com/litv/pdf/mpds018i; PackageVersion: 4073253-4/K; ComponentLink1URL: http://www.ti.com/; ComponentLink1Description: Manufacturer URL; ComponentLink2URL: http://www.ti.com/general/docs/lit/getliterature.tsp?genericPartNumber=TL431&fileType=pdf; ComponentLink2Description: Datasheet; PackageDescription: 5-Pin Plastic Small Outline, Body 1.60 Ã— 2.90 mm, Pitch 0.95 mm; PartNumber: TL431IDBVR

## Sheet MCU_Debug.SchDoc
size A4
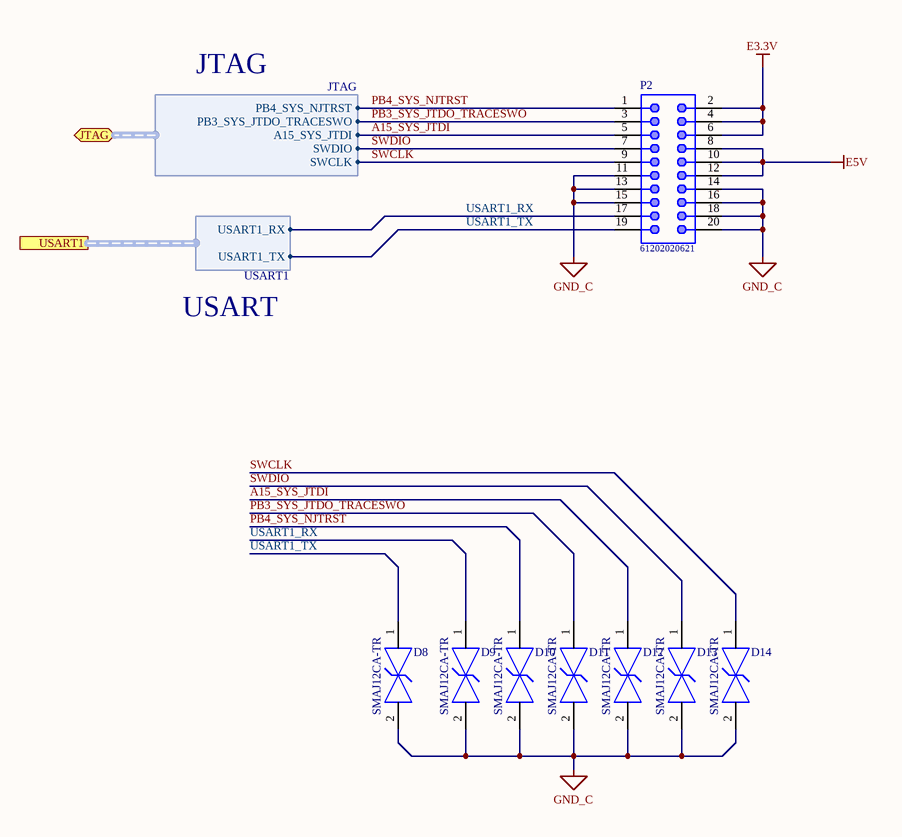
[diagram p5: MCU_Debug.SchDoc]

### Parts
D8  SMAJ12CA-TR  [FP-SMA-CA-MFG]
D9  SMAJ12CA-TR  [FP-SMA-CA-MFG]
D10  SMAJ12CA-TR  [FP-SMA-CA-MFG]
D11  SMAJ12CA-TR  [FP-SMA-CA-MFG]
D12  SMAJ12CA-TR  [FP-SMA-CA-MFG]
D13  SMAJ12CA-TR  [FP-SMA-CA-MFG]
D14  SMAJ12CA-TR  [FP-SMA-CA-MFG]
P2  61202020621  [61202020621]

### Ports
JTAG (bidir, harness JTAG), USART1 (harness USART1)

### Harnesses
JTAG: PB3_SYS_JTDO_TRACESWO, PB4_SYS_NJTRST, SWDIO, SWCLK, A15_SYS_JTDI
USART1: USART1_RX, USART1_TX

### Nets
E3.3V: P2.2 P2.4 P2.6
E5V: P2.8 P2.10 P2.12
GND_C: D8.2 D9.2 D10.2 D11.2 D12.2 D13.2 D14.2 P2.11 P2.13 P2.14 P2.15 P2.16 P2.18 P2.20
A15_SYS_JTDI: D12.1 P2.5 ; port JTAG.A15_SYS_JTDI
PB3_SYS_JTDO_TRACESWO: D11.1 P2.3 ; port JTAG.PB3_SYS_JTDO_TRACESWO
PB4_SYS_NJTRST: D10.1 P2.1 ; port JTAG.PB4_SYS_NJTRST
SWCLK: D14.1 P2.9 ; port JTAG.SWCLK
SWDIO: D13.1 P2.7 ; port JTAG.SWDIO
USART1_RX: D9.1 P2.17 ; port USART1.USART1_RX
USART1_TX: D8.1 P2.19 ; port USART1.USART1_TX

### Notes on the sheet
- JTAG
- USART

### Library data of the parts
D8-D14 = CMP-12225-000045-1: TVS DIODE 12V 25.3V SMA; Manufacturer: STMicroelectronics; Number Of Channels: 1; Breakdown Voltage: 13.3V; Max Junction Temp: +150°C; Clamping Voltage: 19.9V; Peak Pulse Current: 20.1A; Description: 25.3V Clamp 91A (8/20µs) Ipp Tvs Diode Surface Mount SMA (DO-214AC); Standoff Height: 0.05mm; Peak Pulse Power: 400W; Direction: Bidirectional; Package: SMA-CA; Octopart: https://octopart.com/smaj12ca-tr-stmicroelectronics-347060; Device Class L3: unset; Automotive: No; Height: 2.65mm; Reverse Standoff Voltage: 12V; Mouser Description: TVS Diodes - Transient Voltage Suppressors 400W 12V Bidirect; Device Class L2: TVS Diodes; Lead Free: Yes; ComponentLink2URL: https://www.st.com/resource/en/datasheet/smaj.pdf; Digikey Description: TVS DIODE 12V 25.3V SMA; Temperature Range High: +150°C; RoHS: TRUE; Device Class L1: Circuit Protection; Temperature Range Low: -55°C; Temperature: -55°C to +150°C; Category: Diode; ComponentLink2Description: Datasheet; Manufacturer Part Number: SMAJ12CA-TR
P2 = 61202020621: Male Box Header WR-BHD, SMT, Vertical, pitch 2.54 mm, 20 pins; Pitch: 2.54 mm; Working Voltage: 250 VAC; Withstanding Voltage: 500 VAC; Contact Resistance: 20 mOhm; Pin Number: 20; ComponentLink1Description: Manufacturer; ComponentLink1URL: http://www.we-online.de; ComponentLink2Description: Datasheet; ComponentLink2URL: https://katalog.we-online.de/em/datasheet/6120xx20621.pdf; Part Number: 61202020621; Published Date: August 2018; Publisher: Wurth Elektronik; Operating Temperature: -40 to 125 degC; Packaging: Tube; Gender: Male; Mounting Technology: SMT; Orientation: Vertical

## Sheet MCU_USB.SchDoc
size A
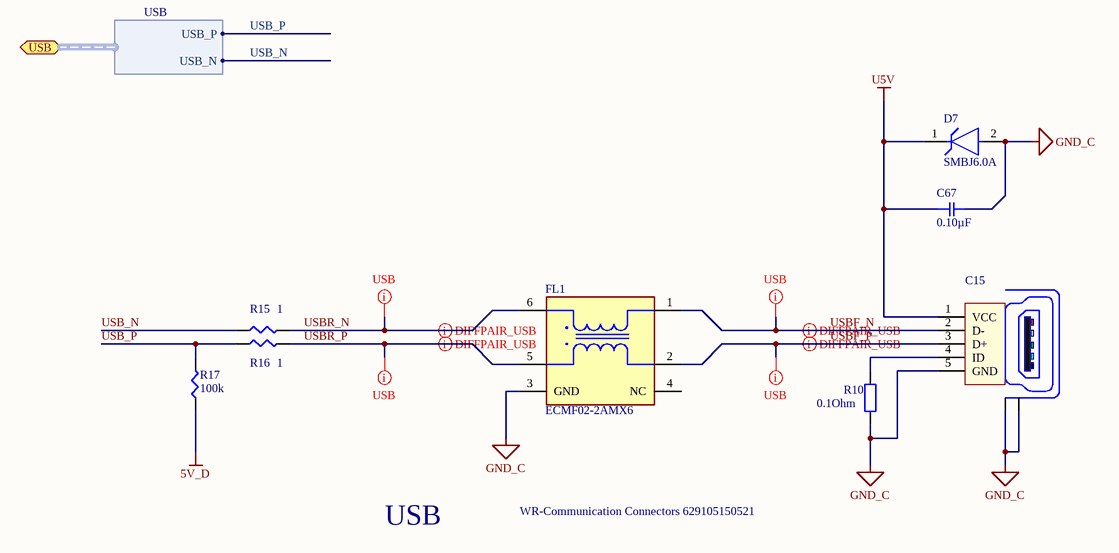
[diagram p6: MCU_USB.SchDoc]

### Parts
C15  WR-Communication Connectors 629105150521  [629105150521]
C67  0.10µF  [SMD-0805C]
D7  SMBJ6.0A  [FP-SMBJ-MFG]
FL1  ECMF02-2AMX6  [FP-QFN-6L-MFG]
R10  0.1Ohm  [WRIS-KSKE_0603_H=0.45mm]
R15  1  [SMD-0603-RES]
R16  1  [SMD-0603-RES]
R17  100k  [SMD-0603-RES]

### Ports
USB (bidir, harness USB)

### Harnesses
USB: USB_P, USB_N

### Nets
5V_D: R17.1
GND_C: C15.5(GND) C15.Z1(Shield) C15.Z2(Shield) C67.2 D7.2(A) FL1.3(GND) R10.2
U5V: C15.1(VCC) C67.1 D7.1(C)
USB_N: R15.1 ; port USB.USB_N
USB_P: R16.1 R17.2 ; port USB.USB_P
USBF_N: C15.2(D-) FL1.1(D+)
USBF_P: C15.3(D+) FL1.2(D-)
USBR_N: FL1.6(D+) R15.2
USBR_P: FL1.5(D-) R16.2
NetC15_4: C15.4(ID) R10.1

Not connected (* = marked no-connect by the designer): FL1 4(NC)

### Layout directives
rule Undefined; rule Matched Net Lengths [Tolerance = 0.2mm]; rule Impedance Constraint [Min = 85.00    Max = 95.00    ]: USBF_N, USBF_P, USBR_N, USBR_P
differential pair; rule Impedance Constraint [Min = 85.00    Max = 95.00    ]: USBF_N, USBF_P, USBR_N, USBR_P

### Notes on the sheet
- USB

### Library data of the parts
C15 = WR-Communication Connectors 629105150521: WR-COM_USB_Micro Type B_Horizontal_SMT; Manufacturer: Würth Elektronik eiSos GmbH; ComponentLink1 Description: Manufacturer; ComponentLink2 Description: Datasheet; NoPins: 5; ComponentLink1URL: http://www.we-online.de; ComponentLink2URL: http://katalog.we-online.de/em/datasheet/629105150521.pdf; Created by: Karrer Zheng; Created Date: 10/21/2014; partNo: 629105150521
C67 = GCJ21BR72A104KA01L: as C41 on sheet MCU_Power; Datasheets: http://www.murata.com/~/media/webrenewal/support/library/catalog/products/capacitor/mlcc/c03e.ashx; Image: //media.digikey.com/Renders/Murata%20Renders/0805%20(2012%20Metric)%20.85mm.jpg; Digi-Key Part Number: 490-5825-1-ND; Part Number: GCJ21BR72A104KA01L; Quantity Available: 1873; @ qty: 0; Packaging: Cut Tape (CT); Series: GCJ; Part Status: Active; Value: 0.10µF; Voltage: 100V; Temperature Coefficient: X7R; Operating Temperature: -55°C ~ 125°C; Features: Soft Termination; Ratings: AEC-Q200; Applications: Automotive, Boardflex Sensitive; Mounting Type: Surface Mount, MLCC; Package / Case: 0805 (2012 Metric); Size / Dimension: 0.079" L x 0.049" W (2.00mm x 1.25mm); Height - Seated (Max): -; Thickness (Max): 0.049" (1.25mm); Lead Spacing: -; Lead Style: -
D7 = CMP-08607-000069-1: as D18 on sheet MCU_Breakout; Category: Diode; ComponentLink2Description: Datasheet; Octopart: https://octopart.com/smbj6.0a-littelfuse-66100; Clamping Voltage: 10.3V; Device Class L3: unset; Temperature Range Low: -65°C; Temperature: -65°C to +150°C; ComponentLink2URL: https://www.littelfuse.com/~/media/electronics/datasheets/tvs_diodes/littelfuse_tvs_diode_smbj_datasheet.pdf.pdf; Height: 2.61mm; Digikey Description: TVS DIODE 6V 10.3V DO214AA; Manufacturer Part Number: SMBJ6.0A; Temperature Range High: +150°C; Device Class L2: TVS Diodes; Mouser Description: In a Pack of 10, Littelfuse SMBJ6.0A, Uni-Directional TVS Diode, 600W, 2-Pin DO-214AA; Automotive: No; RoHS: TRUE; Device Class L1: Circuit Protection; Reverse Standoff Voltage: 6V; Lead Free: Yes; Package: SMBJ
FL1 = CMP-12075-000001-1: CMC 200MA 2LN SMD ESD; Manufacturer: STMicroelectronics; Standoff Height: 0mm; Max Junction Temp: +125°C; Series Resistance: 2.5Ω; Device Class L2: EMI / RFI Components; Device Class L1: Passive Components; Height: 0.55mm; Lead Free: Yes; Package: QFN-6L; Temperature Range Low: -55°C; Octopart: https://octopart.com/ecmf02-2amx6-stmicroelectronics-44353078; Mouser Description: TVS Diodes / ESD Suppressors ESD Mode Filter 6GHz USB 2.0 MIPI 8kV; Device Class L3: Common Mode Chokes; ComponentLink2URL: https://www.st.com/resource/en/datasheet/ecmf02-2amx6.pdf; Ipc Land Pattern Name: DFN170X150X50-6; ComponentLink2Description: Datasheet; Automotive: No; Temperature Range High: +125°C; Temperature: -55°C to +125°C; RoHS: TRUE; Digikey Description: CMC 200MA 2LN SMD ESD; Manufacturer Part Number: ECMF02-2AMX6; Category: Filter
R10 = 560050316001: WRIS-KSKE Thick Film Resistors, size 0603, 0.1Ohm, +/-1%, 0.25W; Rated Current: 1.58A; Temperature Coefficient of Resistance: 250ppm/degC; Technical Reference: KE0603R100F104LAATP0000; ComponentLink1Description: Manufacturer; ComponentLink1URL: http://www.we-online.de; ComponentLink2Description: Datasheet; ComponentLink2URL: https://katalog.we-online.com/pbs/datasheet/560050316001.pdf; Publisher: Wurth Elektronik; Rated Power: 0.25W; Resistance: 0.1Ohm; Mounting Technology: SMT; Height: 0.45mm; Part Number: 560050316001; Packaging: Tape and Reel; Published Date: September 2019; Size: 0603; Length: 1.6mm; Operating Temperature: -55 to +155degC; Resistance Tolerance: +/-1%; Width: 0.8mm
R15 R16 = ERJ-3BQF1R0V: RES SMD 1 OHM 1% 1/4W 0603; Manufacturer: Panasonic Electronic Components; Factory Stock: 0; Unit Price (USD): 0.05386; @ qty: 1500; Power (Watts): 0.25W, 1/4W; Temperature Coefficient: ±200ppm/°C; Part Number: ERJ-3BQF1R0V; Datasheets: https://industrial.panasonic.com/cdbs/www-data/pdf/RDA0000/AOA0000C239.pdf; Image: //media.digikey.com/Photos/Panasonic%20Photos/MFG_ERJ-P6W%20Series.jpg; Digi-Key Part Number: P17371CT-ND; Quantity Available: 30514; Minimum Quantity: 1; Packaging: Cut Tape (CT); Series: ERJ; Part Status: Active; Value: 1; Tolerance: ±1%; Composition: Thick Film; Features: Automotive AEC-Q200, Current Sense; Operating Temperature: -55°C ~ 125°C; Package / Case: 0603 (1608 Metric); Supplier Device Package: 0603; Size / Dimension: 0.063" L x 0.031" W (1.60mm x 0.80mm); Height - Seated (Max): 0.022" (0.55mm); Number of Terminations: 2; Failure Rate: -
R17 = ERJ-3EKF1003V: RES SMD 100K OHM 1% 1/10W 0603; Manufacturer: Panasonic Electronic Components; Factory Stock: 0; Unit Price (USD): 0.00379; @ qty: 1500; Minimum Quantity: 1; Power (Watts): 0.1W, 1/10W; Temperature Coefficient: ±100ppm/°C; Part Number: ERJ-3EKF1003V; Datasheets: http://industrial.panasonic.com/www-cgi/jvcr13pz.cgi?E+PZ+3+AOA0002+ERJ3EKF1003V+7+WW; Image: //media.digikey.com/Photos/Panasonic%20Photos/MFG_ERJ-P6W%20Series.jpg; Digi-Key Part Number: P100KHCT-ND; Quantity Available: 2179804; Packaging: Cut Tape (CT); Series: ERJ; Part Status: Active; Value: 100k; Tolerance: ±1%; Composition: Thick Film; Features: Automotive AEC-Q200; Operating Temperature: -55°C ~ 155°C; Package / Case: 0603 (1608 Metric); Supplier Device Package: 0603; Size / Dimension: 0.063" L x 0.031" W (1.60mm x 0.80mm); Height - Seated (Max): 0.022" (0.55mm); Number of Terminations: 2; Failure Rate: -

## Sheet MCU_LCD.SchDoc
size A4
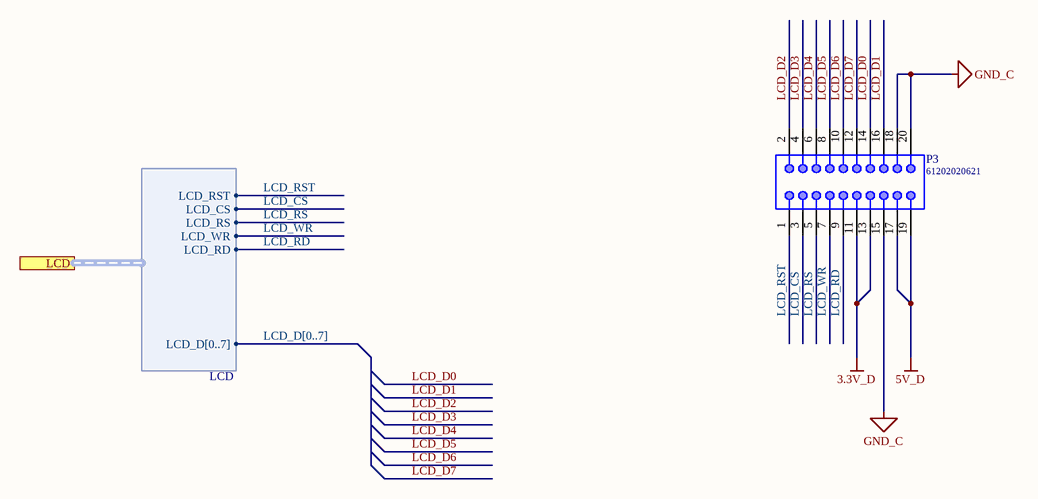
[diagram p7: MCU_LCD.SchDoc]

### Parts
P3  61202020621  [61202020621]

### Ports
LCD (harness LCD)

### Harnesses
LCD: LCD_CS, LCD_D[0..7], LCD_RD, LCD_RS, LCD_RST, LCD_WR

### Nets
3.3V_D: P3.11 P3.13
5V_D: P3.17 P3.19
GND_C: P3.15 P3.18 P3.20
LCD_CS: P3.3 ; port LCD.LCD_CS
LCD_D0: P3.14
LCD_D1: P3.16
LCD_D2: P3.2
LCD_D3: P3.4
LCD_D4: P3.6
LCD_D5: P3.8
LCD_D6: P3.10
LCD_D7: P3.12
LCD_RD: P3.9 ; port LCD.LCD_RD
LCD_RS: P3.5 ; port LCD.LCD_RS
LCD_RST: P3.1 ; port LCD.LCD_RST
LCD_WR: P3.7 ; port LCD.LCD_WR

### Buses and harness runs
bus LCD_D[0..7]

### Library data of the parts
P3 = 61202020621: as P2 on sheet MCU_Debug; ComponentLink1Description: Manufacturer; ComponentLink1URL: http://www.we-online.de; ComponentLink2Description: Datasheet; ComponentLink2URL: https://katalog.we-online.de/em/datasheet/6120xx20621.pdf; Part Number: 61202020621; Published Date: August 2018; Publisher: Wurth Elektronik; Operating Temperature: -40 to 125 degC; Packaging: Tube; Gender: Male; Mounting Technology: SMT; Orientation: Vertical

## Sheet IR_Reciever.SchDoc
size A
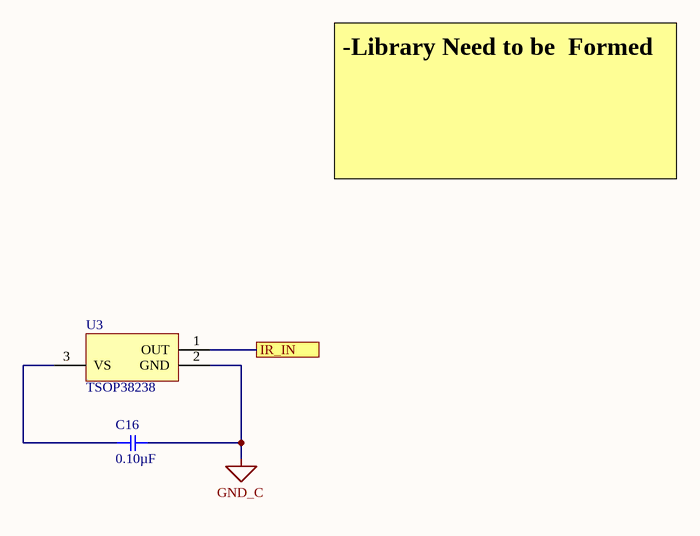
[diagram p8: IR_Reciever.SchDoc]

### Parts
C16  0.10µF  [SMD-0805C]
U3  TSOP38238  [VISH-TSOP38238]

### Ports
IR_IN

### Nets
GND_C: C16.2 U3.2(GND)
IR_IN: U3.1(OUT) ; port IR_IN
NetC16_1: C16.1 U3.3(VS)

### Notes on the sheet
- -Library Need to be  Formed

### Library data of the parts
C16 = GRM21BR71H104KA01K: CAP CER 0.1UF 50V X7R 0805; Manufacturer: Murata Electronics North America; Factory Stock: 0; Unit Price (USD): 0.18; Minimum Quantity: 1; Tolerance: ±10%; Datasheets: http://www.murata.com/~/media/webrenewal/support/library/catalog/products/capacitor/mlcc/c02e.pdf; Image: //media.digikey.com/Renders/Murata%20Renders/0805%20(2012%20Metric)%20.85mm.jpg; Digi-Key Part Number: 490-9754-1-ND; Part Number: GRM21BR71H104KA01K; Quantity Available: 31988; @ qty: 0; Packaging: Cut Tape (CT); Series: GRM; Part Status: Active; Value: 0.10µF; Voltage: 50V; Temperature Coefficient: X7R; Operating Temperature: -55°C ~ 125°C; Features: -; Ratings: -; Applications: General Purpose; Mounting Type: Surface Mount, MLCC; Package / Case: 0805 (2012 Metric); Size / Dimension: 0.079" L x 0.049" W (2.00mm x 1.25mm); Height - Seated (Max): -; Thickness (Max): 0.053" (1.35mm); Lead Spacing: -; Lead Style: -
U3 = CMP-1666-00022-1: IR Receiver Modules for Remote Control System, 2.5 to 5.5 V, -25 to 85 degC, 3-Pin THD, RoHS, Bulk; Tolerance: 30ppm; ESR: 40 Ohm; Capacitance: 1.8E-11 f; Frequency: 24 MHz; Load Capacitance: 18 pF; DatasheetVersion: Rev. 1.5, 07/2016; REACH SVHC: No SVHC; Frequency Tolerance: 30ppm; ComponentLink2URL: http://www.vishay.com/docs/82491/tsop382.pdf; Mount: Surface Mount; Length: 0.197 inch; Min Operating Temperature: -20degC; Packaging: Tape and Reel; ComponentLink1URL: http://www.vishay.com/; Width: 0.126 inch; Height: 0.041 inch; PackageDescription: 3-Pin Through Hole Device, Body 5.00 x 4.80 mm, Pitch 2.54 mm; Max Operating Temperature: 70degC; Pins: 4; RoHSCompliant: True; Package Quantity: 1000; PackageReference: VISH-TSOP38238; ComponentLink2Description: Datasheet; ComponentLink1Description: Manufacturer URL; Resistance: 40 Ohm